# EAGLE design MyRIO_Breakout_Gamma2b (EAGLE 9.2.0)

## Sheet 1 of 2
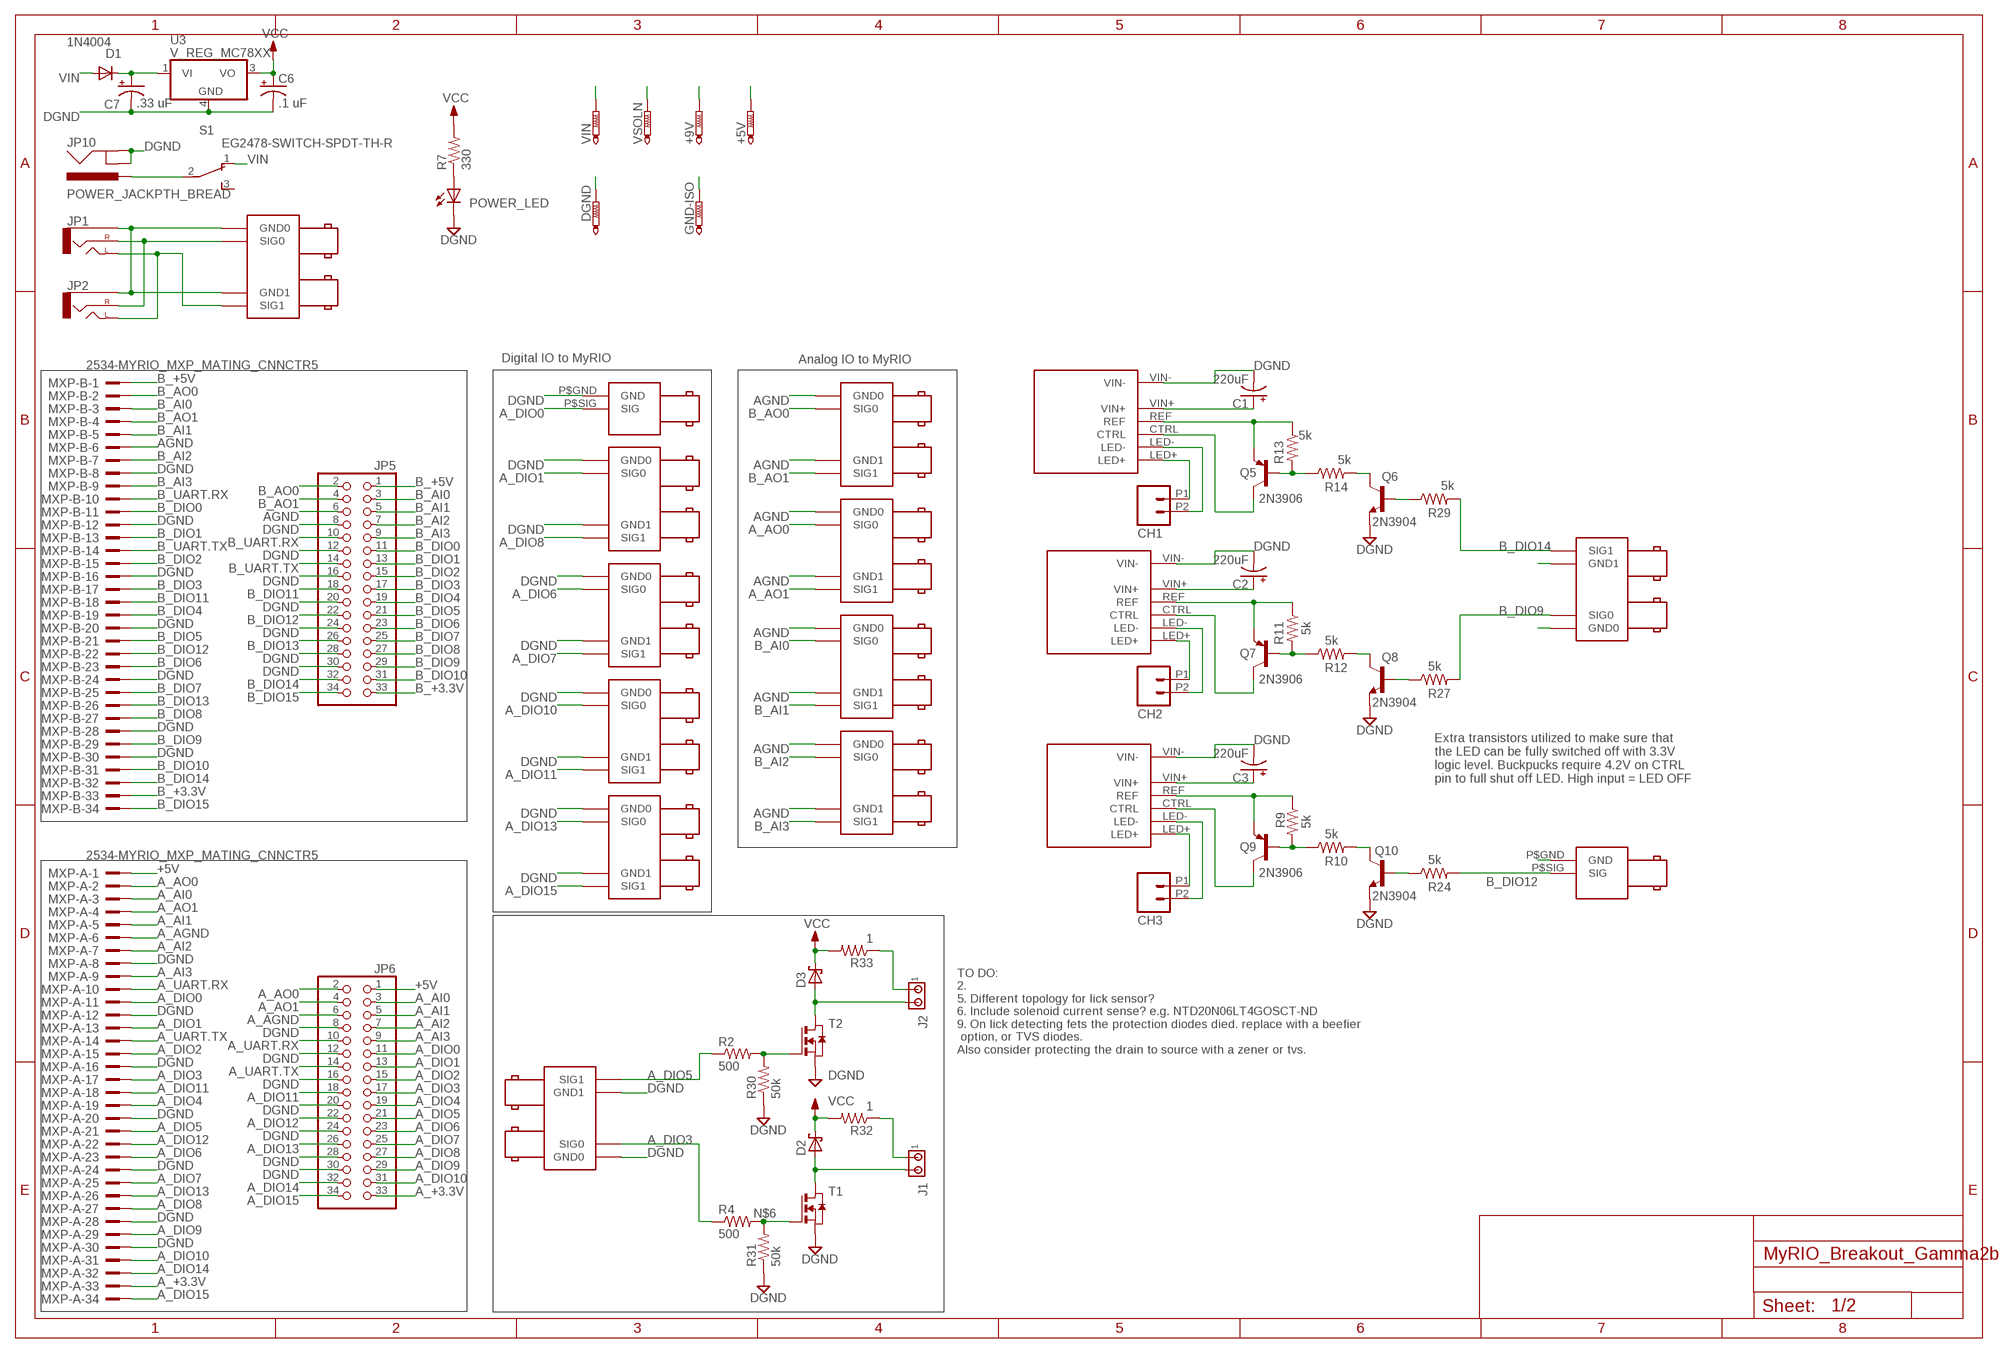
[diagram p0: schematic, sheet 1]

### Parts
+5V  PTR1PAD1-17Y  [P1-17Y]
+9V  PTR1PAD1-17Y  [P1-17Y]
AAO_0,1  BNC_RIGHT_ANGLE_DOUBLE  [BNC_RIGHT_ANGLE_DOUBLE]
ACTV_REC  BNC_RIGHT_ANGLE  [BNC_RIGHT_ANGLE]
AUDIO  BNC_RIGHT_ANGLE_DOUBLE  [BNC_RIGHT_ANGLE_DOUBLE]
BAI_0,1  BNC_RIGHT_ANGLE_DOUBLE  [BNC_RIGHT_ANGLE_DOUBLE]
BAI_2,3  BNC_RIGHT_ANGLE_DOUBLE  [BNC_RIGHT_ANGLE_DOUBLE]
BAO_0,1  BNC_RIGHT_ANGLE_DOUBLE  [BNC_RIGHT_ANGLE_DOUBLE]
BUCKPUCK1  BUCKPUCK-350-I  [BUCKPUCK_I]
BUCKPUCK2  BUCKPUCK-350-I  [BUCKPUCK_I]
BUCKPUCK3  BUCKPUCK-350-I  [BUCKPUCK_I]
C1  220uF  CPOL-USE5-10.5  [E5-10,5]
C2  220uF  CPOL-USE5-10.5  [E5-10,5]
C3  220uF  CPOL-USE5-10.5  [E5-10,5]
C6  .1 uF  CPOL-USE2.5-5  [E2,5-5]
C7  .33 uF  CPOL-USE2.5-5  [E2,5-5]
CAMERA  BNC_RIGHT_ANGLE_DOUBLE  [BNC_RIGHT_ANGLE_DOUBLE]
CH1  M022.54MM_SCREWTERM  [1X02_2.54_SCREWTERM]
CH2  M022.54MM_SCREWTERM  [1X02_2.54_SCREWTERM]
CH3  M022.54MM_SCREWTERM  [1X02_2.54_SCREWTERM]
D1  1N4004  [DO41-10]
D2  SCHOTTKY-DIODE  [DIODE_SMB]
D3  SCHOTTKY-DIODE  [DIODE_SMB]
D_FREE1_2  BNC_RIGHT_ANGLE_DOUBLE  [BNC_RIGHT_ANGLE_DOUBLE]
D_FREE3_4  BNC_RIGHT_ANGLE_DOUBLE  [BNC_RIGHT_ANGLE_DOUBLE]
DGND  PTR1PAD1-17Y  [P1-17Y]
GND-ISO  PTR1PAD1-17Y  [P1-17Y]
J1  MTA02-100  [10X02MTA]
J2  MTA02-100  [10X02MTA]
JP1  AUDIO-JACKPTH  [AUDIO-JACK]
JP2  AUDIO-JACKPTH  [AUDIO-JACK]
JP5  PINHD-2X17  [2X17]
JP6  PINHD-2X17  [2X17]
JP10  POWER_JACKPTH_BREAD  [POWER_JACK_PTH_BREAD]
LED_CUE  BNC_RIGHT_ANGLE  [BNC_RIGHT_ANGLE]
LED_MASK  BNC_RIGHT_ANGLE_DOUBLE  [BNC_RIGHT_ANGLE_DOUBLE]
MXP-A  2534-MYRIO_MXP_MATING_CNNCTR5  [PAK100/2500-5-34-MXP_CONNCTR]
MXP-B  2534-MYRIO_MXP_MATING_CNNCTR5  [PAK100/2500-5-34-MXP_CONNCTR]
POWER_LED  LED3MM  [LED3MM]
Q5  2N3906  MMBT3906LT1-PNP-SOT23-BEC  [SOT23-BEC]
Q6  2N3904  MMBT3904LT1-NPN-SOT23-BEC  [SOT23-BEC]
Q7  2N3906  MMBT3906LT1-PNP-SOT23-BEC  [SOT23-BEC]
Q8  2N3904  MMBT3904LT1-NPN-SOT23-BEC  [SOT23-BEC]
Q9  2N3906  MMBT3906LT1-PNP-SOT23-BEC  [SOT23-BEC]
Q10  2N3904  MMBT3904LT1-NPN-SOT23-BEC  [SOT23-BEC]
R2  500  R-US_M1206  [M1206]
R4  500  R-US_M1206  [M1206]
R7  330  R-US_0207/10  [0207/10]
R9  5k  RESISTOR_SM0805S  [0805S]
R10  5k  RESISTOR_SM0805S  [0805S]
R11  5k  RESISTOR_SM0805S  [0805S]
R12  5k  RESISTOR_SM0805S  [0805S]
R13  5k  RESISTOR_SM0805S  [0805S]
R14  5k  RESISTOR_SM0805S  [0805S]
R24  5k  RESISTOR_SM0805S  [0805S]
R27  5k  RESISTOR_SM0805S  [0805S]
R29  5k  RESISTOR_SM0805S  [0805S]
R30  50k  R-US_M1206  [M1206]
R31  50k  R-US_M1206  [M1206]
R32  1  R-US_M1206  [M1206]
R33  1  R-US_M1206  [M1206]
S1  EG2478-SWITCH-SPDT-TH-R  [ESWITCH_500-SSP1M6]
SHUTTER  BNC_RIGHT_ANGLE_DOUBLE  [BNC_RIGHT_ANGLE_DOUBLE]
SLN  BNC_RIGHT_ANGLE_DOUBLE  [BNC_RIGHT_ANGLE_DOUBLE]
T1  NMOSSOT223  [SOT223]
T2  NMOSSOT223  [SOT223]
U3  V_REG_MC78XX  [DPAK]
VIN  PTR1PAD1-17Y  [P1-17Y]
VSOLN  PTR1PAD1-17Y  [P1-17Y]

### Nets
+5V: +5V.TP JP6.1 MXP-A.1 ; also sheet 2
+9V: +9V.TP ; also sheet 2
A_+3.3V: JP6.33 MXP-A.33
A_AGND: JP6.6 MXP-A.6
A_AI0: JP6.3 MXP-A.3
A_AI1: JP6.5 MXP-A.5
A_AI2: JP6.7 MXP-A.7
A_AI3: JP6.9 MXP-A.9
A_AO0: AAO_0,1.P$SIG0(SIG0) JP6.2 MXP-A.2
A_AO1: AAO_0,1.P$SIG1(SIG1) JP6.4 MXP-A.4
A_DIO0: ACTV_REC.P$SIG(SIG) JP6.11 MXP-A.11
A_DIO1: CAMERA.P$SIG0(SIG0) JP6.13 MXP-A.13
A_DIO2: JP6.15 MXP-A.15 ; also sheet 2
A_DIO3: JP6.17 MXP-A.17 R4.1 SLN.P$SIG0(SIG0)
A_DIO4: JP6.19 MXP-A.19 ; also sheet 2
A_DIO5: JP6.21 MXP-A.21 R2.1 SLN.P$SIG1(SIG1)
A_DIO6: JP6.23 MXP-A.23 SHUTTER.P$SIG0(SIG0)
A_DIO7: JP6.25 MXP-A.25 SHUTTER.P$SIG1(SIG1)
A_DIO8: CAMERA.P$SIG1(SIG1) JP6.27 MXP-A.27
A_DIO9: JP6.29 MXP-A.29
A_DIO10: D_FREE1_2.P$SIG0(SIG0) JP6.31 MXP-A.31
A_DIO11: D_FREE1_2.P$SIG1(SIG1) JP6.18 MXP-A.18
A_DIO12: JP6.22 MXP-A.22
A_DIO13: D_FREE3_4.P$SIG0(SIG0) JP6.26 MXP-A.26
A_DIO14: JP6.32 MXP-A.32
A_DIO15: D_FREE3_4.P$SIG1(SIG1) JP6.34 MXP-A.34
A_UART.RX: JP6.10 MXP-A.10
A_UART.TX: JP6.14 MXP-A.14
AGND: AAO_0,1.P$GND0(GND0) AAO_0,1.P$GND1(GND1) BAI_0,1.P$GND0(GND0) BAI_0,1.P$GND1(GND1) BAI_2,3.P$GND0(GND0) BAI_2,3.P$GND1(GND1) BAO_0,1.P$GND0(GND0) BAO_0,1.P$GND1(GND1) JP5.6 MXP-B.6 ; also sheet 2
B_+3.3V: JP5.33 MXP-B.33
B_+5V: JP5.1 MXP-B.1
B_AI0: BAI_0,1.P$SIG0(SIG0) JP5.3 MXP-B.3
B_AI1: BAI_0,1.P$SIG1(SIG1) JP5.5 MXP-B.5
B_AI2: BAI_2,3.P$SIG0(SIG0) JP5.7 MXP-B.7
B_AI3: BAI_2,3.P$SIG1(SIG1) JP5.9 MXP-B.9
B_AO0: BAO_0,1.P$SIG0(SIG0) JP5.2 MXP-B.2
B_AO1: BAO_0,1.P$SIG1(SIG1) JP5.4 MXP-B.4
B_DIO0: JP5.11 MXP-B.11
B_DIO1: JP5.13 MXP-B.13
B_DIO2: JP5.15 MXP-B.15
B_DIO3: JP5.17 MXP-B.17
B_DIO4: JP5.19 MXP-B.19
B_DIO5: JP5.21 MXP-B.21
B_DIO6: JP5.23 MXP-B.23
B_DIO7: JP5.25 MXP-B.25
B_DIO8: JP5.27 MXP-B.27
B_DIO9: JP5.29 LED_MASK.P$SIG0(SIG0) MXP-B.29 R27.2
B_DIO10: JP5.31 MXP-B.31
B_DIO11: JP5.18 MXP-B.18
B_DIO12: JP5.22 LED_CUE.P$SIG(SIG) MXP-B.22 R24.2
B_DIO13: JP5.26 MXP-B.26
B_DIO14: JP5.32 LED_MASK.P$SIG1(SIG1) MXP-B.32 R29.2
B_DIO15: JP5.34 MXP-B.34
B_UART.RX: JP5.10 MXP-B.10
B_UART.TX: JP5.14 MXP-B.14
BCKPCK_CTRL2: Q8.C R12.2
BCKPCK_CTRL3: Q10.C R10.2
CTRL1: BUCKPUCK1.CTRL Q5.C
CTRL2: BUCKPUCK2.CTRL Q7.C
CTRL3: BUCKPUCK3.CTRL Q9.C
DGND: ACTV_REC.P$GND(GND) BUCKPUCK1.LED- BUCKPUCK1.VIN- BUCKPUCK2.LED- BUCKPUCK2.VIN- BUCKPUCK3.LED- BUCKPUCK3.VIN- C1.- C2.- C3.- C6.- C7.- CAMERA.P$GND0(GND0) CAMERA.P$GND1(GND1) CH1.P2 CH2.P2 CH3.P2 D_FREE1_2.P$GND0(GND0) D_FREE1_2.P$GND1(GND1) D_FREE3_4.P$GND0(GND0) D_FREE3_4.P$GND1(GND1) DGND.TP JP5.8 JP5.12 JP5.16 JP5.20 JP5.24 JP5.28 JP5.30 JP6.8 JP6.12 JP6.16 JP6.20 JP6.24 JP6.28 JP6.30 JP10.GND JP10.GNDBREAK LED_CUE.P$GND(GND) LED_MASK.P$GND0(GND0) LED_MASK.P$GND1(GND1) MXP-A.8 MXP-A.12 MXP-A.16 MXP-A.20 MXP-A.24 MXP-A.28 MXP-A.30 MXP-B.8 MXP-B.12 MXP-B.16 MXP-B.20 MXP-B.24 MXP-B.28 MXP-B.30 POWER_LED.K(C) Q6.E Q8.E Q10.E R30.1 R31.1 SHUTTER.P$GND0(GND0) SHUTTER.P$GND1(GND1) SLN.P$GND0(GND0) SLN.P$GND1(GND1) T1.3(S) T2.3(S) U3.4(GND) ; also sheet 2
GND-ISO: GND-ISO.TP ; also sheet 2
LED1+: BUCKPUCK1.LED+ CH1.P1
LED2+: BUCKPUCK2.LED+ CH2.P1
LED3+: BUCKPUCK3.LED+ CH3.P1
N$2: R2.2 R30.2 T2.1(G)
N$3: AUDIO.P$GND0(GND0) AUDIO.P$GND1(GND1) JP1.SLEEVE JP2.SLEEVE
N$4: AUDIO.P$SIG0(SIG0) JP1.RING(RIGHT) JP2.RING(RIGHT)
N$5: AUDIO.P$SIG1(SIG1) JP1.TIP(LEFT) JP2.TIP(LEFT)
N$6: R4.2 R31.2 T1.1(G)
N$11: BUCKPUCK3.REF Q9.E R9.1
N$13: POWER_LED.A R7.1
N$15: Q9.B R9.2 R10.1
N$16: BUCKPUCK1.VIN+ BUCKPUCK2.VIN+ BUCKPUCK3.VIN+ C1.+ C2.+ C3.+ C7.+ D1.C U3.1(VI) VIN.TP
N$22: BUCKPUCK1.REF Q5.E R13.1
N$24: BUCKPUCK2.REF Q7.E R11.1
N$27: Q10.B R24.1
N$28: Q8.B R27.1
N$29: Q5.B R13.2 R14.1
N$30: Q6.B R29.1
N$32: J1.1 R32.1
N$33: Q7.B R11.2 R12.1
N$36: JP10.PWR S1.2
N$37: J2.1 R33.1
N$42: Q6.C R14.2
VCC: C6.+ D2.C(A) D3.C(A) R7.2 R32.2 R33.2 U3.3(VO) VSOLN.TP
VIN: D1.A S1.1
VOUT-1: D2.A(C) J1.2 T1.2(D) T1.4(D)
VOUT-2: D3.A(C) J2.2 T2.2(D) T2.4(D)
Unconnected: S1.3

### Notes on the sheet
- Digital IO to MyRIO | Analog IO to MyRIO
- Extra transistors utilized to make sure that
  the LED can be fully switched off with 3.3V
  logic level. Buckpucks require 4.2V on CTRL
  pin to full shut off LED. High input = LED OFF
- TO DO:
  2. 
  5. Different topology for lick sensor?
  6. Include solenoid current sense? e.g. NTD20N06LT4GOSCT-ND
  9. On lick detecting fets the protection diodes died. replace with a beefier
   option, or TVS diodes. 
  Also consider protecting the drain to source with a zener or tvs.

## Sheet 2 of 2
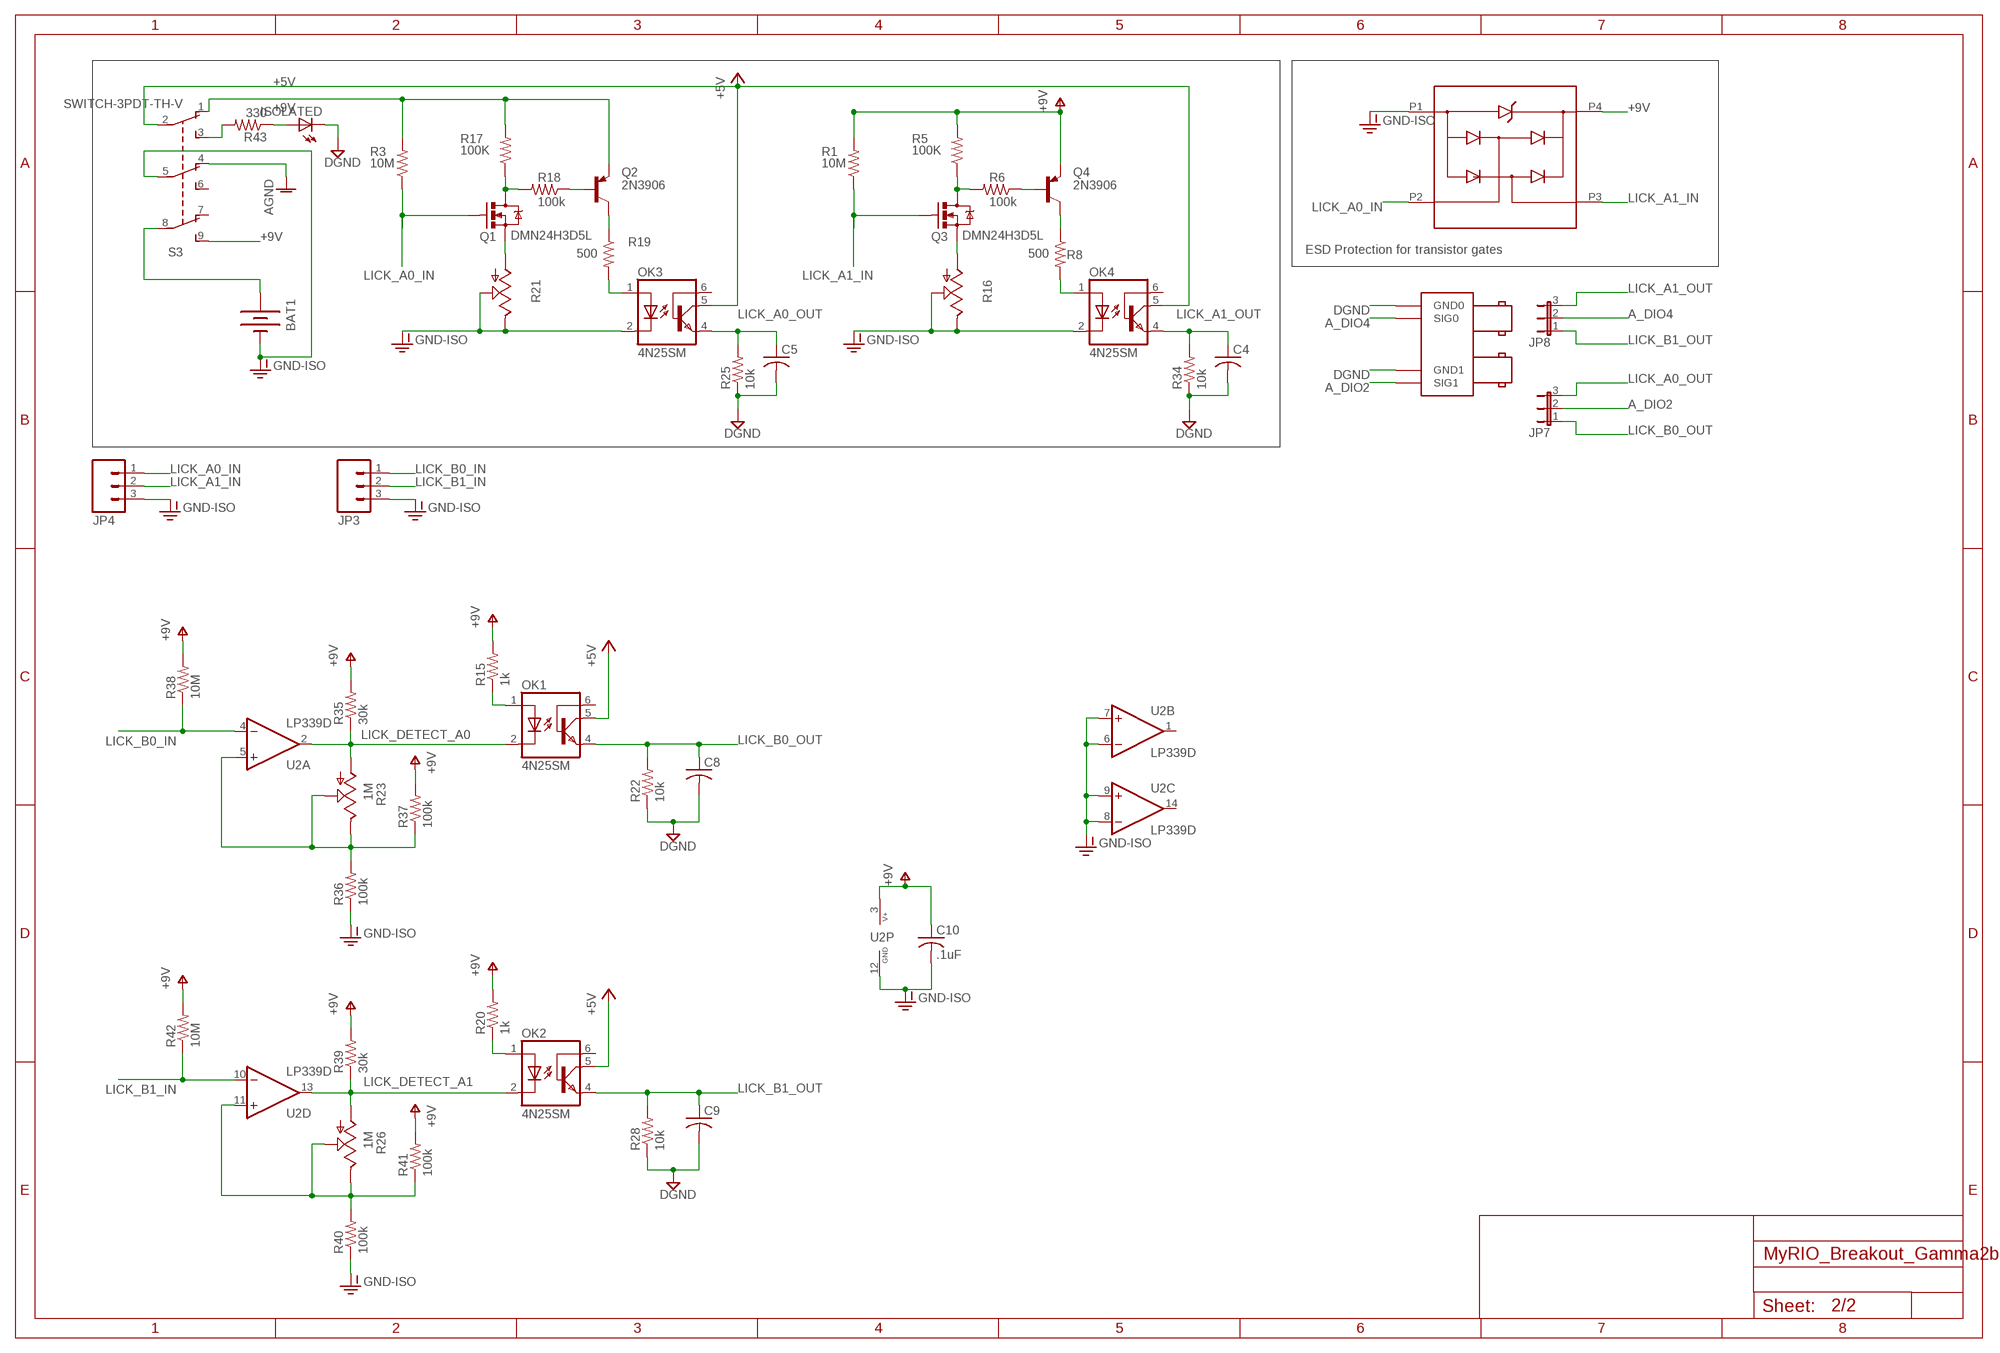
[diagram p1: schematic, sheet 2]

### Parts
BAT1  BATTERY9V  [BATTCON_9V]
C4  C-US025-024X044  [C025-024X044]
C5  C-US025-024X044  [C025-024X044]
C8  C-US025-024X044  [C025-024X044]
C9  C-US025-024X044  [C025-024X044]
C10  .1uF  C-USC0805K  [C0805K]
ISOLATED  LED3MM  [LED3MM]
JP3  M03POLAR  [MOLEX-1X3]
JP4  M03POLAR  [MOLEX-1X3]
JP7  JP2E  [JP2]
JP8  JP2E  [JP2]
LICK  BNC_RIGHT_ANGLE_DOUBLE  [BNC_RIGHT_ANGLE_DOUBLE]
OK1  4N25SM  [DIL6-SMD]
OK2  4N25SM  [DIL6-SMD]
OK3  4N25SM  [DIL6-SMD]
OK4  4N25SM  [DIL6-SMD]
Q1  DMN24H3D5L  MOSFET-NCHANNELAO3404A  [SOT23-3]
Q2  2N3906  MMBT3906LT1-PNP-SOT23-BEC  [SOT23-BEC]
Q3  DMN24H3D5L  MOSFET-NCHANNELAO3404A  [SOT23-3]
Q4  2N3906  MMBT3906LT1-PNP-SOT23-BEC  [SOT23-BEC]
R1  10M  RESISTOR_SM0805S  [0805S]
R3  10M  RESISTOR_SM0805S  [0805S]
R5  100K  RESISTOR_SM0805S  [0805S]
R6  100k  RESISTOR_SM0805S  [0805S]
R8  500  RESISTOR_SM0805S  [0805S]
R15  1k  R-US_M0805  [M0805]
R16  TRIM_US-B25P  [B25P]
R17  100K  RESISTOR_SM0805S  [0805S]
R18  100k  RESISTOR_SM0805S  [0805S]
R19  500  RESISTOR_SM0805S  [0805S]
R20  1k  R-US_M0805  [M0805]
R21  TRIM_US-B25P  [B25P]
R22  10k  R-US_0204/2V  [0204V]
R23  1M  TRIM_US-B25P  [B25P]
R25  10k  R-US_0204/2V  [0204V]
R26  1M  TRIM_US-B25P  [B25P]
R28  10k  R-US_0204/2V  [0204V]
R34  10k  R-US_0204/2V  [0204V]
R35  30k  R-US_M0805  [M0805]
R36  100k  R-US_M0805  [M0805]
R37  100k  R-US_M0805  [M0805]
R38  10M  R-US_M0805  [M0805]
R39  30k  R-US_M0805  [M0805]
R40  100k  R-US_M0805  [M0805]
R41  100k  R-US_M0805  [M0805]
R42  10M  R-US_M0805  [M0805]
R43  330  R-US_0207/10  [0207/10]
S3  SWITCH-3PDT-TH-V  [NKK-M20-9PIN-VERTICAL]
U1  CD143A-12_TVS  [SOT-143]
U2  LP339D  LM339D  [SO14]

### Nets
+5V: OK1.5(COL) OK2.5(COL) OK3.5(COL) OK4.5(COL) S3.2(P1) ; also sheet 1
+9V: C10.1 Q2.E Q4.E R1.2 R3.2 R5.2 R15.2 R17.2 R20.2 R35.2 R37.2 R38.2 R39.2 R41.2 R42.2 S3.1(O1) S3.9(S3) U1.P4 U2.3(P:V+) ; also sheet 1
A_DIO2: JP7.2 LICK.P$SIG1(SIG1) ; also sheet 1
A_DIO4: JP8.2 LICK.P$SIG0(SIG0) ; also sheet 1
AGND: S3.4(O2) ; also sheet 1
DGND: C4.2 C5.2 C8.2 C9.2 ISOLATED.K(C) LICK.P$GND0(GND0) LICK.P$GND1(GND1) R22.1 R25.1 R28.1 R34.1 ; also sheet 1
GND-ISO: BAT1.- C10.2 JP3.3 JP4.3 OK3.2(C) OK4.2(C) R16.E R16.S R21.E R21.S R36.1 R40.1 S3.5(P2) U1.P1 U2.6(B:-IN) U2.7(B:+IN) U2.8(C:-IN) U2.9(C:+IN) U2.12(P:GND) ; also sheet 1
LICK_A0_IN: JP4.1 Q1.1(G) R3.1 U1.P2
LICK_A0_OUT: C5.1 JP7.3 OK3.4(EMI) R25.2
LICK_A1_IN: JP4.2 Q3.1(G) R1.1 U1.P3
LICK_A1_OUT: C4.1 JP8.3 OK4.4(EMI) R34.2
LICK_B0_IN: JP3.1 R38.1 U2.4(A:-IN)
LICK_B0_OUT: C8.1 JP7.1 OK1.4(EMI) R22.2
LICK_B1_IN: JP3.2 R42.1 U2.10(D:-IN)
LICK_B1_OUT: C9.1 JP8.1 OK2.4(EMI) R28.2
LICK_DETECT_A0: OK1.2(C) R23.A R35.1 U2.2(A:OUT)
LICK_DETECT_A1: OK2.2(C) R26.A R39.1 U2.13(D:OUT)
N$1: Q1.3(D) R17.1 R18.2
N$7: Q3.3(D) R5.1 R6.2
N$8: Q4.B R6.1
N$9: OK4.1(A) R8.2
N$10: Q4.C R8.1
N$12: Q3.2(S) R16.A
N$14: Q2.B R18.1
N$17: OK3.1(A) R19.2
N$18: Q2.C R19.1
N$19: Q1.2(S) R21.A
N$20: BAT1.+ S3.8(P3)
N$21: ISOLATED.A R43.1
N$23: OK2.1(A) R20.1
N$25: R43.2 S3.3(S1)
N$34: OK1.1(A) R15.1
N$43: R23.E R23.S R36.2 R37.1 U2.5(A:+IN)
N$45: R26.E R26.S R40.2 R41.1 U2.11(D:+IN)
Unconnected: OK1.6(BAS) OK2.6(BAS) OK3.6(BAS) OK4.6(BAS) S3.6(S2) S3.7(O3) U2.1(B:OUT) U2.14(C:OUT)

### Notes on the sheet
- ESD Protection for transistor gates

## Library data of the parts
+5V +9V DGND GND-ISO VIN VSOLN = testpad:PTR1: TEST PIN
AAO_0,1 AUDIO BAI_0,1 BAI_2,3 BAO_0,1 CAMERA D_FREE1_2 D_FREE3_4 LED_MASK LICK SHUTTER SLN = Pavel_Connectors:BNC_RIGHT_ANGLE_DOUBLE
ACTV_REC LED_CUE = connectors:BNC_RIGHT_ANGLE: BNC plug, through-hole, right-angle
BAT1 = Pavel_ElectroMechanical:BATTERY: Battery Holders Various common sizes : AA, AAA, 18650 (PRT-12895), 20mm coin cell and 12mm coin cell. 20MM_4LEGS, BATT-10373 9V Digikey BH9v-PC-ND
BUCKPUCK1-BUCKPUCK3 = Pavel-PowerIC:BUCKPUCK-*-?
C1-C3 C6 C7 = adafruit:CPOL-US: POLARIZED CAPACITOR, American symbol
C4 C5 C8-C10 = adafruit:C-US: CAPACITOR, American symbol
CH1-CH3 = SparkFun-Connectors:M02: Standard 2-pin 0.1" header. Use with - straight break away headers ( PRT-00116) - right angle break away headers (PRT-00553) - swiss pins (PRT-00743) - machine pins (PRT-00117) - female headers (PRT-00115) Molex polarized connector foot print use with: PRT-08233 with associated crimp pins and housings. 2.54_SCREWTERM for use with PRT-10571. 3.5mm Screw Terminal footprints for PRT-08084 5mm Screw Terminal footprints for use with PRT-08432
D1 = adafruit:1N4004: DIODE General purpose 1N400x type rectifier (With bigger pads) http://www.ladyada.net/library/pcb/eaglelibrary.html
D2 D3 = eagle-ltspice:SCHOTTKY-DIODE: Schottky Diode; SPICEMODEL: NONE; SPICEPREFIX: D; SPICETYPE: diode
ISOLATED POWER_LED = led:LED: LED OSRAM: - CHIPLED LG R971, LG N971, LY N971, LG Q971, LY Q971, LO R971, LY R971 LH N974, LH R974 LS Q976, LO Q976, LY Q976 LO Q996 - Hyper CHIPLED LW Q18S LB Q993, LB Q99A, LB R99A - SideLED LS A670, LO A670, LY A670, LG A670, LP A670 LB A673, LV A673, LT A673, LW A673 LH A674 LY A675 LS A676, LA A676, LO A676, LY A676, LW A676 LS A679, LY A679, LG A679 - Hyper Micro SIDELED® LS Y876, LA Y876, LO Y876, LY Y876 LT Y87S - SmartLED LW L88C, LW L88S LB L89C, LB L89S, LG L890 LS L89K, LO L89K, LY L89K LS L896, LA L896, LO L896, LY L896 - TOPLED LS T670, LO T670, LY T670, LG T670, LP T670 LSG T670, LSP T670, LSY T670, LOP T670, LYG T670 LG T671, LOG T671, LSG T671 LB T673, LV T673, LT T673, LW T673 LH T674 LS T676, LA T676, LO T676, LY T676, LB T676, LH T676, LSB T676, LW T676 LB T67C, LV T67C, LT T67C, LS T67K, LO T67K, LY T67K, LW E67C LS E67B, LA E67B, LO E67B, LY E67B, LB E67C, LV E67C, LT E67C LW T67C LS T679, LY T679, LG T679 LS T770, LO T770, LY T770, LG T770, LP T770 LB T773, LV T773, LT T773, LW T773 LH T774 LS E675, LA E675, LY E675, LS T675 LS T776, LA T776, LO T776, LY T776, LB T776 LHGB T686 LT T68C, LB T68C - Hyper Mini TOPLED® LB M676 - Mini TOPLED Santana® LG M470 LS M47K, LO M47K, LY M47K Source: http://www.osram.convergy.de LUXEON: - LUMILED® LXK2-PW12-R00, LXK2-PW12-S00, LXK2-PW14-U00, LXK2-PW14-V00 LXK2-PM12-R00, LXK2-PM12-S00, LXK2-PM14-U00 LXK2-PE12-Q00, LXK2-PE12-R00, LXK2-PE12-S00, LXK2-PE14-T00, LXK2-PE14-U00 LXK2-PB12-K00, LXK2-PB12-L00, LXK2-PB12-M00, LXK2-PB14-N00, LXK2-PB14-P00, LXK2-PB14-Q00 LXK2-PR12-L00, LXK2-PR12-M00, LXK2-PR14-Q00, LXK2-PR14-R00 LXK2-PD12-Q00, LXK2-PD12-R00, LXK2-PD12-S00 LXK2-PH12-R00, LXK2-PH12-S00 LXK2-PL12-P00, LXK2-PL12-Q00, LXK2-PL12-R00 Source: www.luxeon.com KINGBRIGHT: KA-3528ASYC Source: www.kingbright.com
J1 J2 = con-amp:MTA02-100: AMP connector
JP1 JP2 = SparkFun-Connectors:AUDIO-JACK: 3.5mm Audio Jack Simple 3.5mm common PCB mount audio jack. Variant PTH is our storefront SKU PRT-08032
JP3 JP4 = SparkFun:M03: Header 3 Standard 3-pin 0.1" header. Use with straight break away headers (SKU : PRT-00116), right angle break away headers (PRT-00553), swiss pins (PRT-00743), machine pins (PRT-00117), and female headers (PRT-00115). Molex polarized connector foot print use with SKU : PRT-08232 with associated crimp pins and housings.
JP5 JP6 = pinhead:PINHD-2X17: PIN HEADER
JP7 JP8 = jumper:JP2E: JUMPER
JP10 = SparkFun-Connectors:POWER_JACK: Power Jack Connector This is the standard 5.5mm barrel jack for power. The PTH is the most common, proven, reliable, footprint. The Slot footprint only works if the mill layer is transmitted to the PCB fab house so be warned. Here are the connectors we sell at SparkFun: DC Barrel Power Jack/Connector <https://www.sparkfun.com/products/119> (PRT-00119) DC Barrel Power Jack/Connector (SMD) <https://www.sparkfun.com/products/12748> (PRT-12748) DC Barrel Jack Adapter - Breadboard Compatible <https://www.sparkfun.com/products/10811> (PRT-10811) It is used on this SparkFun product (and many, many others): SparkFun RedBoard - Programmed with Arduino <https://www.sparkfun.com/products/12757> (DEV-12757) Also, if you need a mating power supply or connector, please check these out: Wall Adapter Power Supply - 9VDC 650mA <https://www.sparkfun.com/products/298> (TOL-00298) DC Barrel Jack Adapter - Male <https://www.sparkfun.com/products/10287> (PRT-10287); PROD_ID: PRT-10811
MXP-A MXP-B = Pavel_ElectroMechanical:2534-MYRIO_MXP_MATING_CNNCTR: 3M (TM) Pak 100 4-Wall Header Source: 3M; OC_FARNELL: 9838406; OC_NEWARK: unknown
OK1-OK4 = optocoupler:4N*?M: General Purpose 6-Pin Phototransistor Optocouplers Source: http://www.fairchildsemi.com/ds/4N/4N35-M.pdf; MF: FAIRCHILD SEMICONDUCTOR; MPN: 4N25SM; OC_FARNELL: 1021152; OC_NEWARK: 34C2020
Q1 Q3 = SparkFun-DiscreteSemi:MOSFET-NCHANNEL: Common NMOSFET Parts MFG P/N Store ID Prod ID FDD8780 TRANS-09984 SI7820DN TRANS-11055 FDS6630A IC-08089 2N7002PW TRANS-11151 FQP30N06L COM-10213 TRANS-10060 BSS123LT1G TRANS-08345 BSS138 TRANS-00830 BS170 2N7000; PROD_ID: TRAN-12988
Q2 Q4 Q5 Q7 Q9 = transistor:*-PNP-: PNP Transistror
Q6 Q8 Q10 = transistor-neu-to92:*-NPN-: NPN Transistror
R1 R3 R5 R6 R8-R14 R17-R19 R24 R27 R29 = SteveS:RESISTOR_SM
R2 R4 R7 R15 R20 R22 R25 R28 R30-R43 = adafruit:R-US_: RESISTOR, American symbol
R16 R21 R23 R26 = pot:TRIM_US-: POTENTIOMETER
S1 = Pavel_ElectroMechanical:EG2478-SWITCH-SPDT-TH-R: E-Switch 500 series right-angle slide SPDT Part EG2478-ND<a=https://www.digikey.com/product-detail/en/e-switch/500SSP1S1M6QEA/EG2478-ND/378947>
S3 = Pavel_ElectroMechanical:SWITCH-3PDT-TH-V: 3PDT 9 pin footswitch SF17020F-0302-21R-L Source: 3PDT.jpg
T1 T2 = zetex:NMOSSOT223: MOS FET; OC_FARNELL: unknown; OC_NEWARK: unknown
U1 = Pavel_ICs:CD143A-12_TVS: Bourns TVS Array for data line protection DigiKey PN CD143A-SR12CT-ND
U2 = op-amp:LM339: COMPARATOR - Quad Low Power Low Offset Voltage with open collector; LM139/LM239/LM339/LM2901/LM3302
U3 = Pavel-PowerIC:V_REG_MC78XX: DigiKey MC7815BD2TR4GOSDKR-ND TO-263-3, D2Pak, TO-263AB http://www.digikey.com/product-detail/en/MC7815BD2TR4G/MC7815BD2TR4GOSDKR-ND/3462629

## Net classes
1 power: width 0.508 mm

## Board
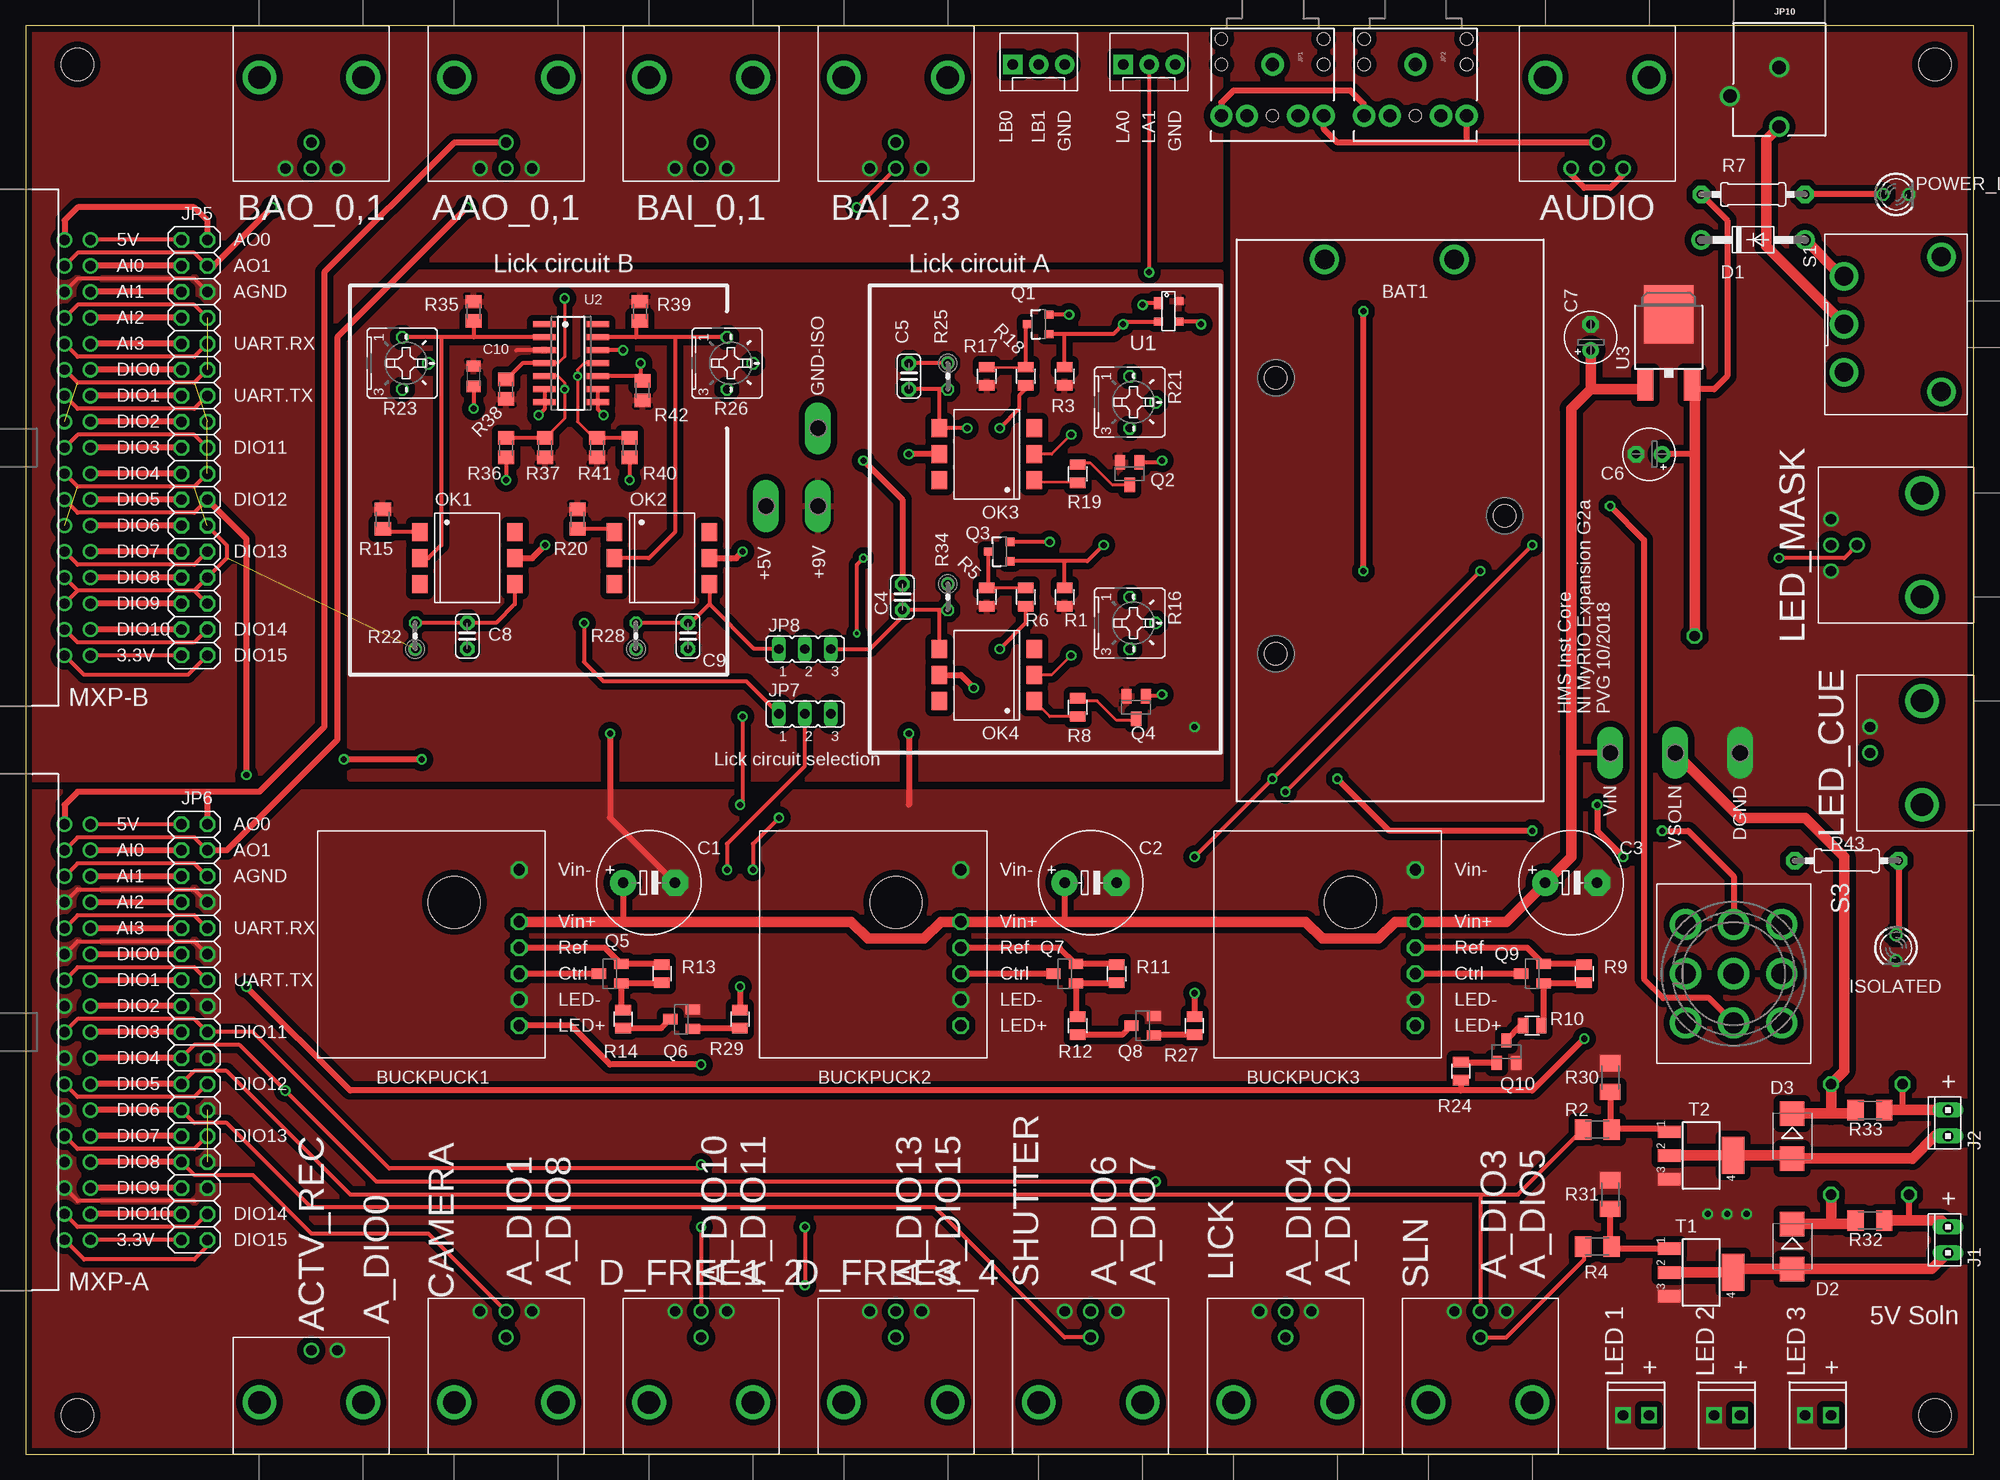
[diagram p2: board, top side]
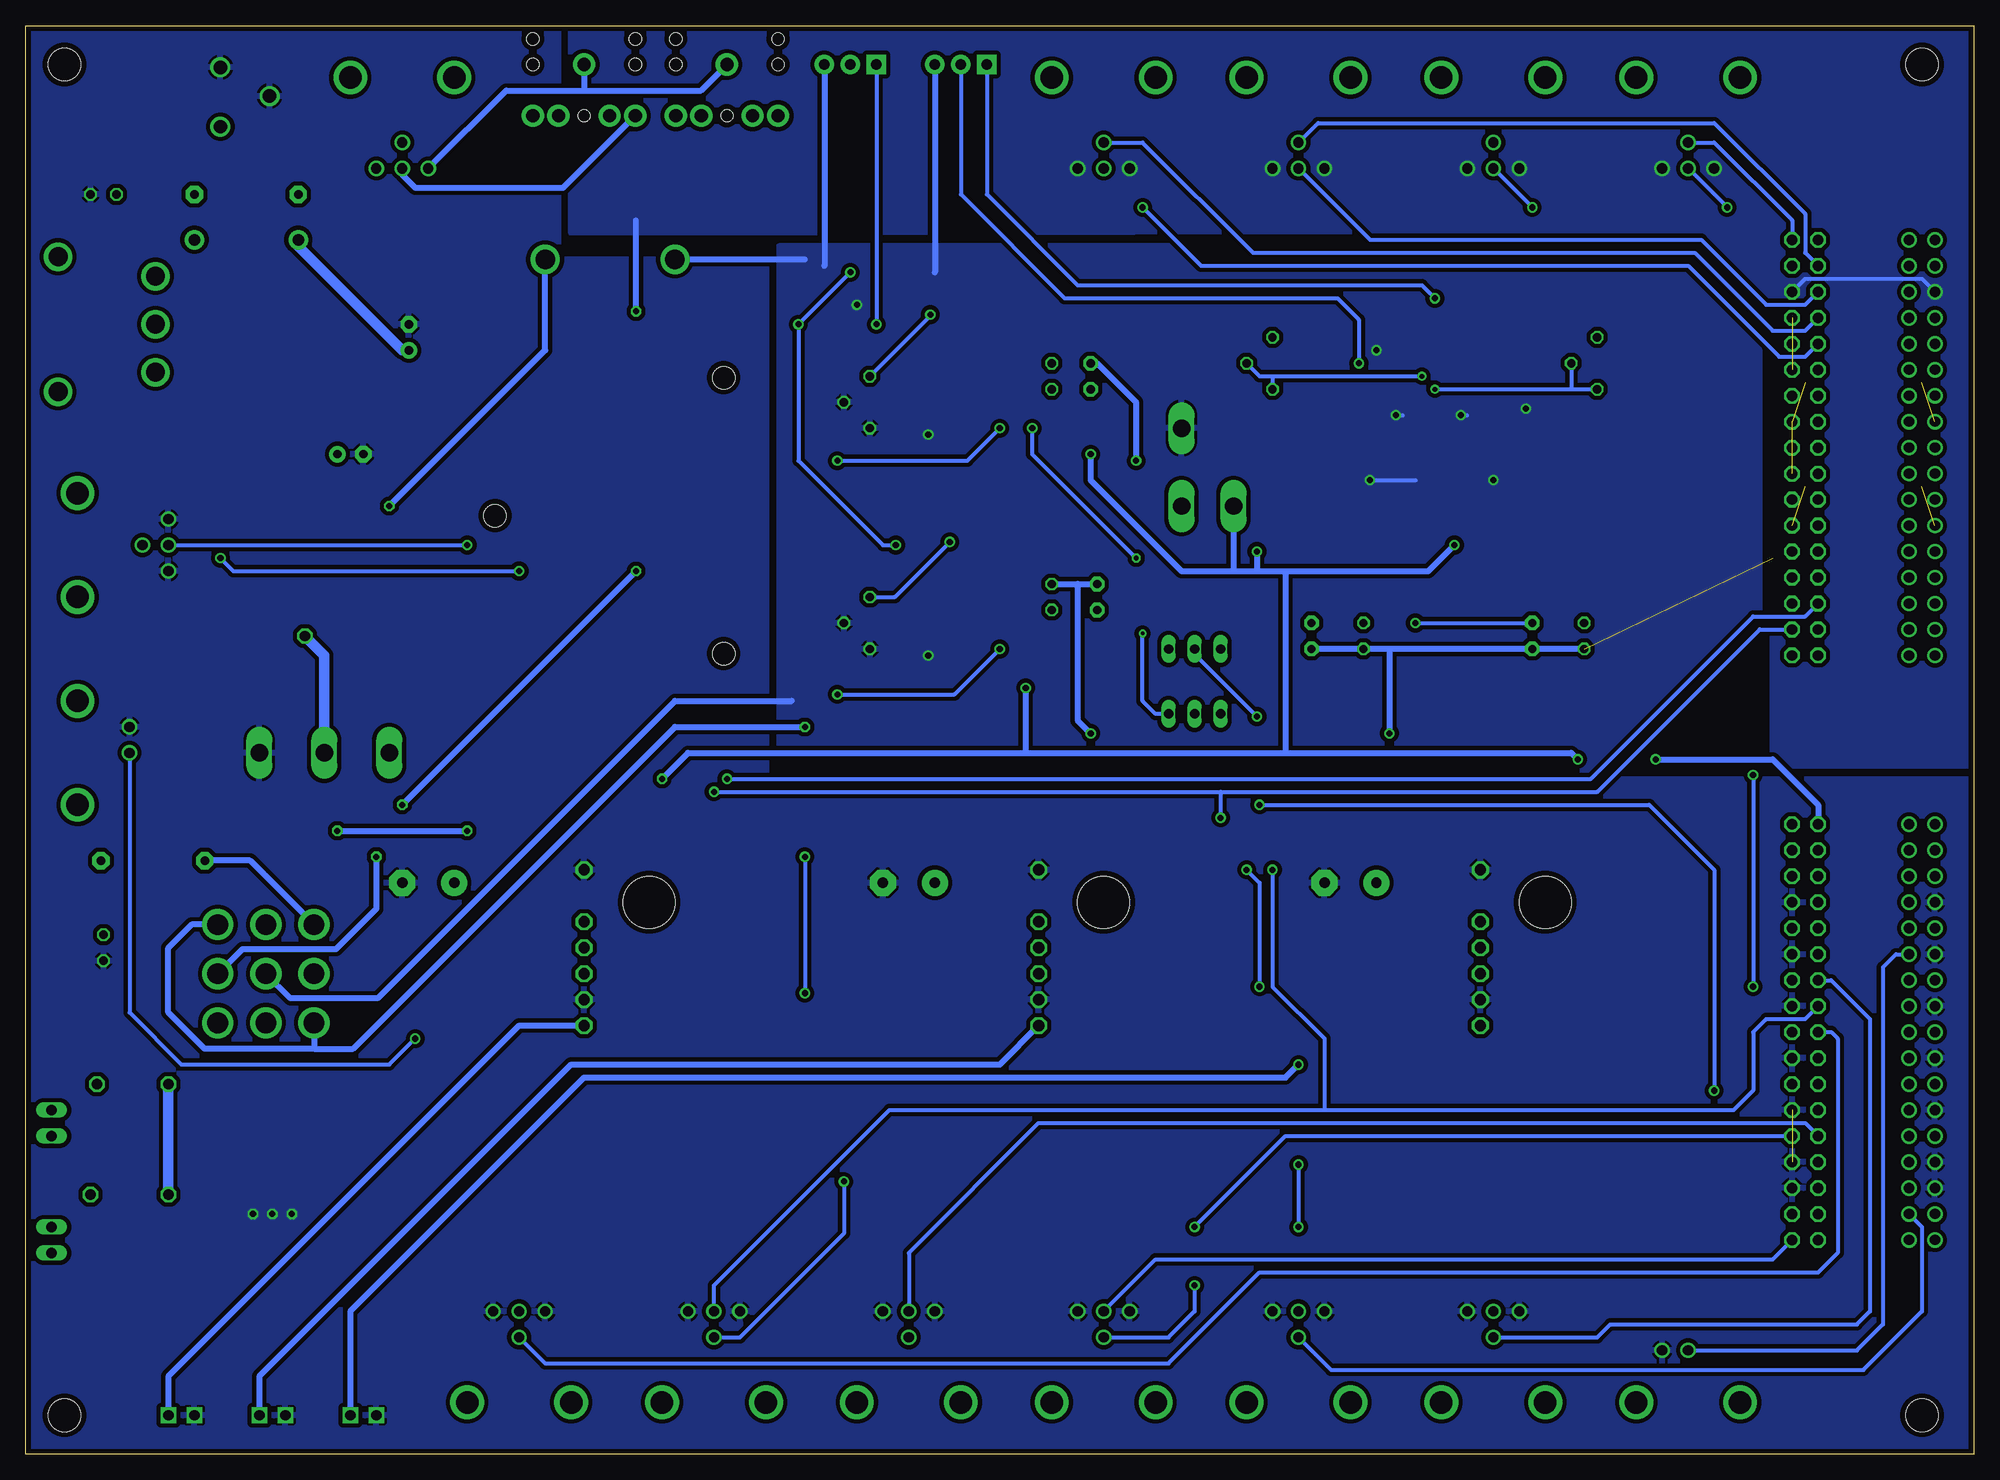
[diagram p3: board, bottom side, seen from below]

Size 190.5 x 139.7 mm. Coordinates in mm from the lower left corner, seen from the top.
Outline: 0,0 190.48,0 190.5,139.7 0,139.7 0,0
Copper layers (1*16): Top 0.0178mm / dielectric 59mil / Bottom 0.0178mm
Design rules "SSC-EAGLE-2Lyr_v1.0.0.3": minimum track width 6mil, minimum drill 14mil, track to track 6mil, track to pad 6mil, pad to pad 6mil, via to via 6mil, smd to smd 6mil, copper to edge 20mil, drill to drill 16mil, minimum pad ring 8mil, minimum via ring 8mil, stop-mask expansion 3mil, vias tented up to drill 0mil, thermal gap 10mil
Holes 3.2 mm at 5.08,3.81 186.69,3.81 186.69,135.89 5.08,135.89

### Footprints (pad centres in the part's own frame; a part is rotated, then mirrored left to right if it is on the bottom)
P1-17Y = drill 1.702 pad 2.121 long: TP 0,0
BNC_RIGHT_ANGLE_DOUBLE = drill 2.2: P$1 0,-5.08; P$2 0,5.08 | drill 1: P$GND0 8.89,-2.54; P$GND1 8.89,2.54; P$SIG0 6.35,0; P$SIG1 8.89,0
BNC_RIGHT_ANGLE = drill 2.2: P$1 -5.08,-6.35; P$2 5.08,-6.35 | drill 1: P$GND -2.54,-11.43; P$SIG 0,-11.43
BATTCON_9V = drill 1.905: + 0,-12.7; - 0,0 | hole 2.2: -11.582,4.75; -38.557,4.75; -25.07,-17.602
BUCKPUCK_I = drill 1.1 octagon: CTRL -8.89,2.54; LED+ -8.89,7.62; LED- -8.89,5.08; REF -8.89,0; VIN+ -8.89,-2.54; VIN- -8.89,-7.62 | hole 5.08: -2.54,-4.445
E5-10,5 = drill 1.016 pad 2.54: + -2.54,0 | drill 1.016 pad 2.54 octagon: - 2.54,0
C025-024X044 = drill 0.813 pad 1.422 octagon: 1 -1.27,0; 2 1.27,0
E2,5-5 = drill 0.813 pad 1.6: + -1.27,0 | drill 0.813 pad 1.6 octagon: - 1.27,0
C0805K = smd 1.1 x 1.4: 1 -1,0; 2 1,0
1X02_2.54_SCREWTERM = drill 1.016 square: P1 2.54,0; P2 0,0
DO41-10 = drill 1.118 pad 1.93: A 5.08,0; C -5.08,0
DIODE_SMB = smd 2.4 x 2.4: A 2.2,0; C -2.2,0
LED3MM = drill 0.813 octagon: A -1.27,0; K 1.27,0
10X02MTA = drill 1.016 long: 1 1.27,0; 2 -1.27,0
AUDIO-JACK = drill 1.3 pad 2.184: RING 5,5; RSH 5,2.5; SLEEVE 0,0; TIP 5,-5; TSH 5,-2.5 | hole 1.2: 0,5; -2.5,5; -2.5,-5; 0,-5; 5,0
MOLEX-1X3 = drill 1.016 pad 1.88 square: 1 0,0 | drill 1.016 pad 1.88: 2 2.54,0; 3 5.08,0
2X17 = drill 1.016 octagon: 1 -20.32,-1.27; 2 -20.32,1.27; 3 -17.78,-1.27; 4 -17.78,1.27; 5 -15.24,-1.27; 6 -15.24,1.27; 7 -12.7,-1.27; 8 -12.7,1.27; 9 -10.16,-1.27; 10 -10.16,1.27; 11 -7.62,-1.27; 12 -7.62,1.27; 13 -5.08,-1.27; 14 -5.08,1.27; 15 -2.54,-1.27; 16 -2.54,1.27; 17 0,-1.27; 18 0,1.27; 19 2.54,-1.27; 20 2.54,1.27; 21 5.08,-1.27; 22 5.08,1.27; 23 7.62,-1.27; 24 7.62,1.27; 25 10.16,-1.27; 26 10.16,1.27; 27 12.7,-1.27; 28 12.7,1.27; 29 15.24,-1.27; 30 15.24,1.27; 31 17.78,-1.27; 32 17.78,1.27; 33 20.32,-1.27; 34 20.32,1.27
JP2 = drill 0.914 long: 1 -2.54,0; 2 0,0; 3 2.54,0
POWER_JACK_PTH_BREAD = drill 1.3: GND 0,7.9; GNDBREAK 4.8,10.7; PWR 0,13.7
PAK100/2500-5-34-MXP_CONNCTR = drill 1 pad 1.422: 1 20.32,-1.27; 2 20.32,1.27; 3 17.78,-1.27; 4 17.78,1.27; 5 15.24,-1.27; 6 15.24,1.27; 7 12.7,-1.27; 8 12.7,1.27; 9 10.16,-1.27; 10 10.16,1.27; 11 7.62,-1.27; 12 7.62,1.27; 13 5.08,-1.27; 14 5.08,1.27; 15 2.54,-1.27; 16 2.54,1.27; 17 0,-1.27; 18 0,1.27; 19 -2.54,-1.27; 20 -2.54,1.27; 21 -5.08,-1.27; 22 -5.08,1.27; 23 -7.62,-1.27; 24 -7.62,1.27; 25 -10.16,-1.27; 26 -10.16,1.27; 27 -12.7,-1.27; 28 -12.7,1.27; 29 -15.24,-1.27; 30 -15.24,1.27; 31 -17.78,-1.27; 32 -17.78,1.27; 33 -20.32,-1.27; 34 -20.32,1.27
DIL6-SMD = smd 1.78 x 1.52: 1 -2.54,-4.645; 2 0,-4.645; 3 2.54,-4.645; 4 2.54,4.645; 5 0,4.645; 6 -2.54,4.645
SOT23-3 = smd 0.8 x 0.9: 1 -0.95,-1; 2 0.95,-1; 3 0,1.1
SOT23-BEC = smd 1 x 1.4: B -0.95,-1.1; C 0,1.1; E 0.95,-1.1
0805S = smd 1.016 x 1.524: 1 -0.889,0; 2 0.889,0
M1206 = smd 1.6 x 2: 1 -1.4,0; 2 1.4,0
0207/10 = drill 0.813 pad 1.676 octagon: 1 -5.08,0; 2 5.08,0
M0805 = smd 1.3 x 1.6: 1 -0.95,0; 2 0.95,0
B25P = drill 0.813 octagon: A -2.54,0; E 2.54,0; S 0,2.54
0204V = drill 0.813 octagon: 1 -1.27,0; 2 1.27,0
ESWITCH_500-SSP1M6 = drill 1.854: 1 -4.699,-5.08; 2 0,-5.08; 3 4.699,-5.08; MT1 -6.604,4.445; MT2 6.604,4.445
NKK-M20-9PIN-VERTICAL = drill 2.032: 1 -4.801,4.699; 2 -4.801,0; 3 -4.801,-4.699; 4 0,4.699; 5 0,0; 6 0,-4.699; 7 4.801,4.699; 8 4.801,0; 9 4.801,-4.699
SOT223 = smd 1.219 x 2.235: 1 -2.311,-3.099; 2 0,-3.099; 3 2.311,-3.099 | smd 3.6 x 2.2: 4 0,3.099
SOT-143 = smd 0.9 x 1.2: P1 -1,0.8 | smd 0.9 x 0.8: P2 -1,-1; P3 1,-1; P4 1,1
SO14 = smd 0.6 x 2.2: 1 -3.81,-2.6; 2 -2.54,-2.6; 3 -1.27,-2.6; 4 0,-2.6; 5 1.27,-2.6; 6 2.54,-2.6; 7 3.81,-2.6; 8 3.81,2.6; 9 2.54,2.6; 10 1.27,2.6; 11 0,2.6; 12 -1.27,2.6; 13 -2.54,2.6; 14 -3.81,2.6
DPAK = smd 1.6 x 3: 1 -2.28,-5.31; 3 2.28,-5.31 | smd 4.826 x 5.715: 4 0,1.588

### Placement (x,y rotation side)
+5V  72.39,92.71 0 top
+9V  77.47,92.71 0 top
AAO_0,1  46.99,134.62 270 top
ACTV_REC  27.94,-1.27 180 top
AUDIO  153.67,134.62 270 top
BAI_0,1  66.04,134.62 270 top
BAI_2,3  85.09,134.62 270 top
BAO_0,1  27.94,134.62 270 top
BAT1  127,116.84 90 top
BUCKPUCK1  39.37,49.53 180 top
BUCKPUCK2  82.55,49.53 180 top
BUCKPUCK3  127,49.53 180 top
C1  60.96,55.88 0 top
C2  104.14,55.88 0 top
C3  151.13,55.88 0 top
C4  85.72,83.82 90 top
C5  86.36,105.41 90 top
C6  158.75,97.79 180 top
C7  153.03,109.22 90 top
C8  43.18,80.01 270 top
C9  64.77,80.01 270 top
C10  43.81,105.41 270 top
CAMERA  46.99,5.08 90 top
CH1  156.21,3.81 0 top
CH2  165.1,3.81 0 top
CH3  173.99,3.81 0 top
D1  168.91,118.75 0 top
D2  172.72,20.32 270 top
D3  172.72,31.11 270 top
D_FREE1_2  66.04,5.08 90 top
D_FREE3_4  85.09,5.08 90 top
DGND  167.64,68.58 0 top
GND-ISO  77.47,100.33 0 top
ISOLATED  182.88,49.53 270 top
J1  187.96,20.95 90 top
J2  187.96,32.38 90 top
JP1  121.92,135.89 270 top
JP2  135.89,135.89 270 top
JP3  96.52,135.89 0 top
JP4  107.31,135.89 0 top
JP5  16.51,98.42 270 top
JP6  16.51,41.27 270 top
JP7  76.2,72.39 0 top
JP8  76.2,78.74 0 top
JP10  171.45,143.51 180 top
LED_CUE  191.77,68.58 270 top
LED_MASK  185.42,88.9 180 top
LICK  123.19,5.08 90 top
MXP-A  5.08,41.27 90 top
MXP-B  5.08,98.42 90 top
OK1  43.18,87.63 270 top
OK2  62.23,87.63 270 top
OK3  93.98,97.79 90 top
OK4  93.98,76.2 90 top
POWER_LED  182.88,123.19 0 top
Q1  99.06,110.49 90 top
Q2  107.95,95.89 180 top
Q3  95.25,88.27 90 top
Q4  108.58,73.03 180 top
Q5  57.15,46.99 90 top
Q6  64.14,42.55 90 top
Q7  101.6,46.99 90 top
Q8  109.22,41.91 90 top
Q9  147.32,46.99 90 top
Q10  144.78,39.37 0 top
R1  101.6,83.82 270 top
R2  153.67,31.75 0 top
R3  101.6,105.41 270 top
R4  153.67,20.32 0 top
R5  93.98,83.82 270 top
R6  97.79,83.82 90 top
R7  168.91,123.19 180 top
R8  102.87,73.03 270 top
R9  152.4,46.99 270 top
R10  147.32,41.91 180 top
R11  106.68,46.99 270 top
R12  102.87,41.91 270 top
R13  62.23,46.99 270 top
R14  58.42,42.55 270 top
R15  34.92,91.44 90 top
R16  107.95,81.28 270 top
R17  93.98,105.41 270 top
R18  97.79,105.41 90 top
R19  102.87,95.89 270 top
R20  53.98,91.44 90 top
R21  107.95,102.87 270 top
R22  38.1,80.01 90 top
R23  36.83,106.68 270 top
R24  140.34,37.47 270 top
R25  90.17,105.41 270 top
R26  68.58,106.68 270 top
R27  114.3,41.91 90 top
R28  59.69,80.01 90 top
R29  69.85,42.55 90 top
R30  154.94,36.83 270 top
R31  154.94,25.4 270 top
R32  180.34,22.86 180 top
R33  180.34,33.66 180 top
R34  90.17,83.82 270 top
R35  43.81,111.76 90 top
R36  46.99,98.42 90 top
R37  50.8,98.42 270 top
R38  46.99,104.14 270 top
R39  60.07,111.76 90 top
R40  59.05,98.42 90 top
R41  55.88,98.42 270 top
R42  60.33,104.01 270 top
R43  178.05,58.04 180 top
S1  182.88,110.49 270 top
S3  167,46.99 270 top
SHUTTER  104.14,5.08 90 top
SLN  142.24,5.08 90 top
T1  163.83,17.78 270 top
T2  163.83,29.21 270 top
U1  111.76,111.76 0 top
U2  53.34,106.68 270 top
U3  160.66,109.86 0 top
VIN  154.94,68.58 0 top
VSOLN  161.29,68.58 0 top

### Tracks (layer width: path | path; a pad name or v marks a point on that pad's centre or on a via)
+5V  (via drill 0.6)
  Top 0.406: JP6.1 MXP-A.1
  Top 0.61: OK3.5 v86.36,97.79 | v92.71,74.93 91.44,76.2 OK4.5 | v38.73,67.94 v31.11,67.94 | v128.27,66.04 133.35,60.96 v147.32,60.96 | v160.02,60.96 162.56,60.96 167,56.52 S3.2 | OK1.5 49.53,87.63 v50.8,88.9 | OK2.5 69.47,87.63 v70.1,88.27
  Bottom 0.61: v31.11,67.94 19.68,67.94 15.24,63.5 JP6.1 | 70.1,86.36 67.31,86.36 | 67.31,86.36 53.34,86.36 v50.8,88.9 | v86.36,97.79 86.36,95.25 77.47,86.36 72.39,86.36 | 67.31,86.36 67.31,68.58 | v128.27,66.04 125.73,68.58 92.71,68.58 | 92.71,68.58 67.31,68.58 | v160.02,60.96 v147.32,60.96 | 67.31,68.58 39.37,68.58 v38.73,67.94 | 72.39,86.36 70.1,86.36 | v70.1,88.27 70.1,86.36 | +5V.TP 72.39,86.36 | v92.71,74.93 92.71,68.58
+9V  (via drill 0.6)
  Top 0.406: U2.3 48.01,107.95
  Bottom 0.61: 162.31,39.65 158.47,39.65 127,71.12 v114.3,71.12 | S3.1 174.27,51.79 176.53,49.53 176.53,43.18 173,39.65 162.31,39.65 | S3.9 162.31,39.65
  pour Top (isolate 0.61): 31.75,109.22 38.1,115.57 116.84,115.57 116.84,66.04 31.75,66.04
A_+3.3V
  Top 0.406: JP6.33 MXP-A.33
A_AGND
  Top 0.406: JP6.6 16.51,57.78 5.08,57.78 MXP-A.6
A_AI0
  Top 0.61: JP6.3 MXP-A.3
A_AI1
  Top 0.61: JP6.5 MXP-A.5
A_AI2
  Top 0.61: JP6.7 MXP-A.7
A_AI3
  Top 0.61: JP6.9 MXP-A.9
A_AO0
  Top 0.61: MXP-A.2 3.81,63.5 5.08,64.77 17.78,64.77 | 17.78,64.77 JP6.2 | 17.78,64.77 22.86,64.77 29.21,71.12 29.21,115.57 41.91,128.27 AAO_0,1.P$SIG0
A_AO1  (via drill 0.6)
  Top 0.406: MXP-A.4 5.08,60.33 16.51,60.33 JP6.4
  Top 0.61: JP6.4 19.68,59.05 30.48,69.85 30.48,109.22 v43.18,121.92
  Bottom 0.406: AAO_0,1.P$SIG1 v43.18,121.92
A_DIO0
  Top 0.61: JP6.11 MXP-A.11
  Bottom 0.406: MXP-A.11 7.62,48.9 8.89,47.62 8.89,12.7 11.43,10.16 ACTV_REC.P$SIG
A_DIO1
  Top 0.61: JP6.13 MXP-A.13
  Bottom 0.406: JP6.13 13.97,46.35 10.16,42.55 10.16,13.97 11.43,12.7 35.56,12.7 36.83,11.43 CAMERA.P$SIG0
A_DIO2  (via drill 0.6)
  Top 0.406: v68.58,57.15 68.58,59.69 76.2,67.31 JP7.2
  Top 0.61: JP6.15 MXP-A.15
  Bottom 0.406: JP6.15 16.51,42.55 20.32,42.55 21.59,41.27 21.59,35.56 23.5,33.66 63.5,33.66 | 63.5,33.66 106.05,33.66 123.19,16.51 LICK.P$SIG1 | 63.5,33.66 63.5,40.64 68.58,45.72 v68.58,57.15
A_DIO3
  Top 0.406: SLN.P$SIG0 144.78,11.43 152.4,19.05 152.4,20.19 R4.1
  Top 0.61: JP6.17 MXP-A.17
  Bottom 0.406: JP6.17 13.97,41.27 13.34,40.64 13.34,19.68 15.24,17.78 69.85,17.78 78.74,8.89 139.7,8.89 SLN.P$SIG0
A_DIO4  (via drill 0.6)
  Top 0.406: JP6.19 16.51,40.01 20.95,40.01 v25.4,35.56 34.29,26.67 v110.49,26.67 | v70.1,72.14 70.1,63.75 v69.85,63.5
  Top 0.61: JP6.19 MXP-A.19
  Bottom 0.406: v25.4,35.56 25.4,57.15 31.75,63.5 v69.85,63.5 | LICK.P$SIG0 120.65,11.43 110.49,21.59 v110.49,26.67 | JP8.2 76.2,78.23 v70.1,72.14
A_DIO5
  Top 0.406: 142.24,25.4 31.75,25.4 19.68,37.47 16.51,37.47 JP6.21 | 142.24,25.4 SLN.P$SIG1 | 142.24,25.4 145.92,25.4 R2.1
  Top 0.61: JP6.21 MXP-A.21
A_DIO6
  Top 0.406: JP6.23 16.51,32.38 19.68,32.38 27.94,24.13 88.9,24.13 101.6,11.43 SHUTTER.P$SIG0
  Top 0.61: JP6.23 MXP-A.23
A_DIO7
  Top 0.61: JP6.25 MXP-A.25
  Bottom 0.406: JP6.25 16.51,32.38 91.44,32.38 104.14,19.68 SHUTTER.P$SIG1
A_DIO8
  Top 0.406: JP6.27 16.51,27.3 22.23,27.3 27.94,21.59 39.37,21.59 CAMERA.P$SIG1
  Top 0.61: JP6.27 MXP-A.27
A_DIO9
  Top 0.61: JP6.29 MXP-A.29
A_DIO10
  Top 0.61: JP6.31 MXP-A.31
  Bottom 0.406: MXP-A.31 5.08,22.23 5.08,13.97 10.79,8.26 62.87,8.26 D_FREE1_2.P$SIG0
A_DIO11  (via drill 0.6)
  Top 0.406: MXP-A.18 5.08,42.55 16.51,42.55 JP6.18 22.23,41.27 35.56,27.94 65.66,27.94 v66.04,28.32 | v66.04,22.23 D_FREE1_2.P$SIG1
  Bottom 0.406: v66.04,28.32 v66.04,22.23
A_DIO12
  Top 0.406: MXP-A.22 5.08,34.92 16.51,34.92 JP6.22
A_DIO13  (via drill 0.6)
  Top 0.406: MXP-A.26 5.08,29.84 16.51,29.84 JP6.26 | v76.2,22.23 v76.2,16.51
  Bottom 0.406: v76.2,16.51 76.2,13.97 78.74,11.43 D_FREE3_4.P$SIG0 | v76.2,22.23 67.31,31.11 JP6.26
A_DIO14
  Top 0.406: MXP-A.32 5.08,22.23 16.51,22.23 JP6.32
A_DIO15
  Top 0.406: MXP-A.34 5.71,19.05 16.51,19.05 17.78,20.32 JP6.34
  Bottom 0.406: JP6.34 19.68,19.05 80.01,19.05 D_FREE3_4.P$SIG1
A_UART.RX
  Top 0.406: JP6.10 16.51,52.7 5.08,52.7 MXP-A.10
A_UART.TX
  Top 0.406: JP6.14 16.51,47.62 5.08,47.62 MXP-A.14
AGND  (via drill 0.6)
  Top 0.406: MXP-B.6 5.08,114.94 16.51,114.94 JP5.6
  Top 0.61: v153.67,63.5 153.67,60.96 v156.21,58.42 | v130.81,86.36 v130.81,111.76
  Bottom 0.406: MXP-B.6 5.08,114.94 16.51,114.94 JP5.6
  Bottom 0.61: v156.21,58.42 156.21,53.34 160.15,49.4 169.29,49.4 S3.4 | v153.67,63.5 v130.81,86.36 | v130.81,111.76 130.81,120.65
  pour Top (isolate 0.61, rank 3, no thermals): 116.84,141.24 -2.54,142.24 -2.54,66.04 30.48,66.04 30.48,110.49 36.83,116.84 116.84,116.84
  pour Bottom (isolate 0.406, no thermals): -1.27,67.31 19.68,67.31 19.68,112.39 26.89,119.6 137.16,119.38 137.16,143.51 -1.27,143.51
B_+3.3V
  Top 0.406: JP5.33 MXP-B.33
B_+5V
  Top 0.406: JP5.1 MXP-B.1
B_AI0
  Top 0.61: JP5.3 MXP-B.3
  Bottom 0.406: JP5.3 16.51,117.47 16.51,121.28 25.4,130.18 64.14,130.18 BAI_0,1.P$SIG0
B_AI1
  Top 0.61: JP5.5 MXP-B.5
  Bottom 0.406: JP5.5 16.51,112.39 20.32,112.39 26.67,118.75 59.05,118.75 BAI_0,1.P$SIG1
B_AI2
  Top 0.61: JP5.7 MXP-B.7
  Bottom 0.406: JP5.7 16.51,109.86 19.68,109.86 27.3,117.47 70.48,117.47 81.28,128.27 BAI_2,3.P$SIG0
B_AI3  (via drill 0.6)
  Top 0.406: BAI_2,3.P$SIG1 v81.28,121.92
  Top 0.61: JP5.9 MXP-B.9
  Bottom 0.406: JP5.9 16.51,107.31 19.05,107.31 27.94,116.2 75.56,116.2 v81.28,121.92
B_AO0
  Top 0.61: MXP-B.2 3.81,120.65 5.08,121.92 16.51,121.92 17.78,120.65 JP5.2
  Bottom 0.406: JP5.2 17.78,120.65 25.4,128.27 BAO_0,1.P$SIG0
B_AO1  (via drill 0.6)
  Top 0.406: MXP-B.4 5.08,117.47 16.51,117.47 JP5.4
  Top 0.61: v24.13,121.92 18.41,116.2 JP5.4
  Bottom 0.406: BAO_0,1.P$SIG1 v24.13,121.92
B_DIO0
  Top 0.61: JP5.11 MXP-B.11
B_DIO1
  Top 0.61: JP5.13 MXP-B.13
B_DIO2
  Top 0.61: JP5.15 MXP-B.15
B_DIO3
  Top 0.61: JP5.17 MXP-B.17
B_DIO4
  Top 0.61: JP5.19 MXP-B.19
B_DIO5
  Top 0.61: JP5.21 MXP-B.21
B_DIO6
  Top 0.61: JP5.23 MXP-B.23
B_DIO7
  Top 0.61: JP5.25 MXP-B.25
B_DIO8
  Top 0.61: JP5.27 MXP-B.27
B_DIO9  (via drill 0.6)
  Top 0.406: v114.3,58.42 v121.92,66.04 v142.24,86.36 | LED_MASK.P$SIG0 177.8,87.63 v171.45,87.63
  Top 0.61: JP5.29 MXP-B.29 | v114.3,45.09 R27.2
  Bottom 0.406: v114.3,58.42 v114.3,45.09 | v121.92,66.04 37.47,66.04 21.59,81.92 16.51,81.92 JP5.29 | v171.45,87.63 170.18,86.36 v142.24,86.36
B_DIO10
  Top 0.61: JP5.31 MXP-B.31
B_DIO11
  Top 0.406: JP5.18 16.51,99.69 5.08,99.69 MXP-B.18
B_DIO12  (via drill 0.6)
  Top 0.406: MXP-B.22 5.08,92.08 16.51,92.08 JP5.22
  Top 0.61: v21.59,45.72 31.75,35.56 140.34,35.56 | v21.59,66.42 21.59,89.53 JP5.22 | 140.34,35.56 147.32,35.56 v152.4,40.64 | R24.2 140.34,35.56
  Bottom 0.406: v21.59,66.42 v21.59,45.72 | LED_CUE.P$SIG 180.34,43.18 175.26,38.1 154.94,38.1 v152.4,40.64
B_DIO13
  Top 0.406: JP5.26 16.51,87 5.08,87 MXP-B.26
B_DIO14  (via drill 0.6)
  Top 0.406: MXP-B.32 5.08,79.38 16.51,79.38 JP5.32 | v147.32,88.9 v123.19,64.77 | v71.12,57.15 71.12,59.69 v73.66,62.23
  Top 0.61: v69.85,45.72 R29.2
  Bottom 0.406: JP5.32 20.95,80.64 36.83,64.77 73.66,64.77 | v123.19,64.77 73.66,64.77 | LED_MASK.P$SIG1 v147.32,88.9 | v69.85,45.72 69.85,55.88 v71.12,57.15 | 73.66,64.77 v73.66,62.23
B_DIO15
  Top 0.406: MXP-B.34 5.71,76.2 15.88,76.2 JP5.34
B_UART.RX
  Top 0.406: JP5.10 16.51,107.31 5.08,107.31 MXP-B.10
B_UART.TX
  Top 0.406: MXP-B.14 5.08,102.23 16.51,102.23 JP5.14
BCKPCK_CTRL2
  Top 0.61: R12.2 107.23,41.02 Q8.C
BCKPCK_CTRL3
  Top 0.61: Q10.C 146.22,41.91 R10.2
CTRL1
  Top 0.61: Q5.C BUCKPUCK1.CTRL
CTRL2
  Top 0.61: Q7.C BUCKPUCK2.CTRL
CTRL3
  Top 0.61: Q9.C BUCKPUCK3.CTRL
DGND  (via drill 0.6)  (8 unrouted)
  Top 0.254: 86.39,106.5 C5.2
  Top 0.406: MXP-A.30 5.08,24.77 16.51,24.77 | MXP-B.8 5.08,112.39 16.51,112.39 JP5.8 | R25.1 C5.2 | MXP-A.8 5.08,55.24 16.51,55.24 JP6.8 | MXP-A.12 5.08,50.16 16.51,50.16 JP6.12 | JP5.30 16.51,84.45 | 16.51,84.45 5.08,84.45 | 5.08,84.45 MXP-B.30 | 16.51,84.45 JP5.28 19.68,87.63 19.68,88.9 JP5.24 | 5.08,84.45 MXP-B.28 | JP5.12 16.51,104.78 5.08,104.78 MXP-B.12 | JP5.20 16.51,94.61 5.08,94.61 MXP-B.20
  Top 0.61: v86.36,70.48 86.36,63.5 | v81.92,97.16 85.72,93.34 C4.2 | C1.- 57.15,62.23 v57.15,70.48
  Bottom 0.61: R34.1 87.63,85.09 | 87.63,85.09 C4.2 | 87.63,85.09 87.63,71.75 v86.36,70.48 | v81.92,97.16 81.92,102.87 85.72,106.68 C5.2 | 57.15,78.74 v57.15,70.48 | R22.1 C8.2 57.15,78.74 | 57.15,78.74 R28.1 C9.2
  other vias: 164.47,23.5 166.37,23.5 168.28,23.5
  pour Bottom (isolate 0.406, rank 2): -1.27,-1.27 191.77,-1.27 191.77,143.51 138.43,143.51 138.43,116.84 118.11,116.84 118.11,66.04 -1.27,66.04
  pour Top (isolate 0.61, rank 2, no thermals): -2.54,-3.81 -2.54,64.77 118.11,64.77 118.11,140.97 191.77,140.97 191.77,-3.81
GND-ISO  (via drill 0.6)
  Top 0.305: OK3.2 100.33,97.79 v102.23,99.69 | OK4.2 100.33,76.2 v102.23,78.11
  Top 0.406: v58.42,107.95 U2.12 | R36.1 v46.99,95.25 | R40.1 v59.05,95.25 | C10.2 v43.81,102.23 | U1.P1 109.39,112.56 v109.22,112.39 | U2.6 U2.7 50.74,102.17 v50.16,101.6 | U2.9 U2.8 55.94,102.17 v56.52,101.6
  Bottom 0.254: R21.E 107.82,100.33
  Bottom 0.406: v59.05,95.25 54.61,95.25 | v50.16,101.6 49.53,101.6 | v56.52,101.6 55.88,101.6
  Bottom 0.61: JP4.3 112.39,116.2 | BAT1.- 114.3,116.84 | JP3.3 101.6,115.57 | 115.57,73.66 127,73.66 156.08,44.58 164.59,44.58 S3.5
  pour Bottom (isolate 0.406): 116.84,66.04 20.95,66.04 20.95,107.95 31.11,118.11 116.84,118.11
LED1+  (via drill 0.6)
  Top 0.61: BUCKPUCK1.LED+ 53.34,41.91 57.15,38.1 v66.04,38.1
  Bottom 0.61: v66.04,38.1 67.31,36.83 135.89,36.83 158.75,13.97 CH1.P1
LED2+
  Bottom 0.61: BUCKPUCK2.LED+ 95.25,38.1 137.16,38.1 167.64,7.62 CH2.P1
LED3+
  Bottom 0.61: CH3.P1 176.53,7.62 142.24,41.91 BUCKPUCK3.LED+
LICK_A0_IN  (via drill 0.6)
  Top 0.406: U1.P2 107.58,110.76 v107.31,110.49 106.36,109.54 101.6,109.54 | 101.6,109.54 Q1.1 | R3.1 101.6,109.54
  Bottom 0.406: JP4.1 v107.31,110.49
LICK_A0_OUT  (via drill 0.36, 0.45, 0.6)
  Top 0.406: R25.2 89.53,104.14 | 89.53,104.14 C5.1 | 89.53,104.14 89.33,103.94 OK3.4 v92.08,100.33 | v81.28,80.26 81.28,87 v81.92,87.63
  Bottom 0.406: v92.08,100.33 92.08,97.79 v81.92,87.63 | JP7.3 80.01,72.39 81.28,73.66 v81.28,80.26
LICK_A1_IN  (via drill 0.6)
  Top 0.406: v105.41,88.9 103.83,87.31 101.6,87.31 | JP4.2 v109.86,115.57 | v114.94,110.49 114.67,110.76 U1.P3 | 101.6,87.31 Q3.1 | R1.1 101.6,87.31
  Bottom 0.406: v105.41,88.9 106.68,88.9 114.94,97.16 v114.94,110.49 v109.86,115.57
LICK_A1_OUT
  Top 0.406: R34.2 89.53,82.55 | 89.53,82.55 C4.1 85.72,81.92 82.55,78.74 JP8.3 | OK4.4 89.33,82.35 89.53,82.55
LICK_B0_IN  (via drill 0.6)
  Top 0.305: v52.7,113.03 52.7,107.31 52.07,106.68 50.8,106.68 U2.4
  Top 0.406: R38.1 48.58,106.68 50.8,106.68
  Bottom 0.406: JP3.1 96.52,123.19 87.63,114.3 53.98,114.3 v52.7,113.03
LICK_B0_OUT  (via drill 0.6)
  Top 0.406: OK1.4 47.83,83.11 45.99,81.28 C8.1 R22.2 | v54.61,81.28 54.61,77.47 56.52,75.56 70.48,75.56 JP7.1
  Bottom 0.406: v54.61,81.28 C8.1
LICK_B1_IN  (via drill 0.6)
  Top 0.406: R42.1 59.88,105.41 | 59.88,105.41 U2.10 | v60.14,106.68 60.14,105.67 59.88,105.41
  Bottom 0.406: JP3.2 99.06,123.19 88.9,113.03 62.23,113.03 60.14,110.94 v60.14,106.68
LICK_B1_OUT
  Top 0.406: OK2.4 66.88,83.11 | 66.88,83.11 71.25,78.74 JP8.1 | R28.2 C9.1 65.04,81.28 66.88,83.11
LICK_DETECT_A0
  Top 0.406: U2.2 43.81,109.22 | 43.81,109.22 40.64,109.22 | 40.64,109.22 R23.A | R35.1 43.81,109.22 | 40.64,109.22 40.64,88.9 39.37,87.63 OK1.2
LICK_DETECT_A1
  Top 0.406: 59.69,109.22 U2.13 | R26.A 63.5,109.22 | 63.5,109.22 59.69,109.22 | 59.69,109.22 59.69,110.43 R39.1 | 63.5,109.22 63.5,90.17 60.96,87.63 OK2.2
N$1
  Top 0.254: R17.1 94.18,106.27 97.74,106.27 R18.2
  Top 0.406: R18.2 97.79,110.32 Q1.3
N$2
  Top 0.61: R30.2 154.94,31.88 155,31.82 | R2.2 155,31.82 | T2.1 160.44,31.82 155,31.82
N$3
  Top 0.61: AUDIO.P$GND0 151.13,125.09 152.4,123.83 154.94,123.83 156.21,125.09 AUDIO.P$GND1
  Bottom 0.61: JP1.SLEEVE 124.46,133.35 135.89,133.35 | 135.89,133.35 143.51,133.35 AUDIO.P$GND0 | JP2.SLEEVE 135.89,133.35
N$4
  Top 0.61: JP1.RING 126.92,129.62 128.27,128.27 140.97,128.27 | AUDIO.P$SIG0 140.97,128.27 | JP2.RING 140.89,128.35 140.97,128.27
N$5
  Top 0.61: JP1.TIP 116.92,132.16 118.11,133.35 129.54,133.35 130.81,132.08 130.81,130.97 JP2.TIP
  Bottom 0.61: JP2.TIP 137.96,123.83 152.4,123.83 153.67,125.09 AUDIO.P$SIG1
N$6
  Top 0.61: T1.1 155.07,20.09 R4.2 154.94,20.32 R31.2
N$7
  Top 0.254: 94.09,84.69 R5.1
  Top 0.305: R6.2 R5.1
  Top 0.406: Q3.3 94.09,88.2 94.09,84.69
N$8  (via drill 0.6)
  Top 0.406: R6.1 97.79,81.28 v95.25,78.74 | v111.12,74.3 110.95,74.12 Q4.B
  Bottom 0.406: v111.12,74.3 99.69,74.3 v95.25,78.74
N$9
  Top 0.305: R8.2 100.15,72.14 OK4.1
N$10
  Top 0.305: R8.1 103.12,73.66 104.78,73.66 106.68,71.75 108.42,71.75 Q4.C
N$11
  Top 0.61: BUCKPUCK3.REF 146.83,49.53 Q9.E 152.34,47.94 R9.1
N$12  (via drill 0.61)
  Top 0.305: v100.13,89.2 100.12,89.22
  Top 0.406: 100.12,89.22 Q3.2
  Bottom 0.406: v100.13,89.2 105.51,83.82 R16.A
N$13
  Top 0.61: POWER_LED.A R7.1
N$14  (via drill 0.6)
  Top 0.406: v95.25,100.33 97.16,102.23 97.16,103.5 97.79,104.14 R18.1 | v111.12,97.16 110.95,96.98 Q2.B
  Bottom 0.406: v111.12,97.16 98.42,97.16 v95.25,100.33
N$15
  Top 0.61: R9.2 152.34,46.04 Q9.B 148.42,41.7 R10.1
N$16
  Top 0.61: C1.+ 58.42,52.07 | C2.+ 101.6,52.07 | VIN.TP 151.13,68.58
  Top 1.016: BUCKPUCK1.VIN+ 58.42,52.07 80.7,52.07 82.35,50.42 87.83,50.42 89.48,52.07 BUCKPUCK2.VIN+ 101.6,52.07 125.15,52.07 126.8,50.42 132.28,50.42 133.93,52.07 BUCKPUCK3.VIN+ 144.78,52.07 C3.+ 151.13,58.42 151.13,68.58 151.13,102.23 153.03,104.14 | U3.1 157.97,104.14 153.03,104.14 | C7.+ 153.03,104.14
  Bottom 1.016: D1.C 163.83,118.11 153.67,107.95 C7.+
N$17
  Top 0.254: R19.2 102.77,95.07 98.75,95.07 OK3.1
N$18
  Top 0.254: 103,96.9 R19.1
  Top 0.305: 103,96.9 104.14,96.9 106.26,94.78 Q2.C
N$19  (via drill 0.61)
  Top 0.406: v102.03,111.43 Q1.2
  Bottom 0.406: v102.03,111.43 102.03,111.33 R21.A
N$20  (via drill 0.6)
  Top 0.61: v154.94,92.71 158.24,89.41 158.24,46.48 160.12,44.6 164.59,44.6 S3.8
  Bottom 0.61: v154.94,92.71 139.7,107.95 BAT1.+
N$21
  Top 0.61: R43.1 183.13,51.05 ISOLATED.A
N$22
  Top 0.61: BUCKPUCK1.REF 56.66,49.53 Q5.E 62.17,47.94 R13.1
N$23
  Top 0.406: OK2.1 57.27,90.49 R20.1
N$24
  Top 0.61: BUCKPUCK2.REF 101.11,49.53 Q7.E 106.62,47.94 R11.1
N$25
  Bottom 0.61: S3.3 168.55,58.04 R43.2
N$27
  Top 0.61: R24.1 140.42,38.27 Q10.B
N$28
  Top 0.61: R27.1 110.38,41.02 Q8.B
N$29
  Top 0.61: R13.2 62.17,46.04 Q5.B 58.25,43.6 R14.1
N$30
  Top 0.61: R29.1 65.3,41.66 Q6.B
N$32  (via drill 1)
  Top 0.61: v184.15,25.4 184.15,22.86
  Top 1.016: R32.1 184.15,22.86 187.32,22.86 J1.1
N$33
  Top 0.61: R11.2 106.62,46.04 Q7.B 102.7,42.97 R12.1
N$34
  Top 0.406: R15.1 35.24,90.17 OK1.1
N$36
  Top 1.016: JP10.PWR 170.18,128.54 170.18,118.11 S1.2
N$37  (via drill 1)
  Top 0.61: v183.51,36.2 183.51,33.66
  Top 1.016: J2.1 183.51,33.66 R33.1
N$42
  Top 0.61: R14.2 62.15,41.66 Q6.C
N$43  (via drill 0.45)
  Top 0.305: U2.5 52.07,105.41 52.7,104.78 v52.7,104.14 52.7,101.28 R37.1
  Top 0.406: R37.1 R36.2
  Bottom 0.406: 39.37,104.14 R23.E | v52.7,104.14 39.37,104.14 | R23.S 39.37,104.14
N$45  (via drill 0.45)
  Top 0.305: U2.11 54.61,106.68 53.98,106.05 v53.98,105.41 53.98,100.97 55.56,99.38 R41.1
  Top 0.406: R40.2 R41.1
  Bottom 0.406: R26.S 69.85,105.41 68.58,105.41 | 68.58,105.41 v53.98,105.41 | 68.58,105.41 R26.E
VCC  (via drill 1)
  Top 0.61: 163.19,97.79 C6.+ | R7.2 166.37,120.65 166.37,105.41 165.1,104.14 163.19,104.14
  Top 1.016: 176.53,22.52 D2.C | 176.53,22.52 178.6,22.52 R32.2 | 176.53,33.31 D3.C | 176.53,33.31 178.6,33.31 R33.2 | v176.53,25.4 176.53,22.52 | 176.53,33.31 v176.53,36.2 177.8,37.47 177.8,58.42 173.99,62.23 167.64,62.23 VSOLN.TP | v163.19,80.01 163.19,97.79 163.19,104.14 163.19,104.28 U3.3
  Bottom 1.016: v176.53,36.2 v176.53,25.4 | v163.19,80.01 161.29,78.11 VSOLN.TP
VIN
  Top 1.016: S1.1 177.55,115.19 D1.A
VOUT-1
  Top 1.016: J1.2 186.4,18.12 D2.A 167.64,18.12 | 167.64,18.12 166.93,18.12 T1.4 | 167.64,18.12 167.3,17.78 T1.2
VOUT-2
  Top 1.016: J2.2 186.69,31.11 184.47,28.89 184.44,28.91 D3.A 172.43,29.21 T2.4 T2.2

### Text on the board
tPlace: LB0 | LB1 | GND | LA0 | LA1 | GND | 5V | AO0 | AI0 | AO1 | AI1 | AGND | AI2 | AI3 | UART.RX | DIO0 | DIO1 | UART.TX | DIO2 | DIO3 | DIO11 | DIO4 | DIO5 | DIO12 | DIO6 | DIO7 | DIO13 | DIO8 | DIO9 | DIO10 | DIO14 | 3.3V | DIO15 | HMS Inst Core / NI MyRIO Expansion G2a / PVG 10/2018 | 5V | AO0 | AI0 | AO1 | AI1 | AGND | AI2 | AI3 | UART.RX | DIO0 | DIO1 | UART.TX | DIO2 | DIO3 | DIO11 | DIO4 | DIO5 | DIO12 | + | DIO6 | DIO7 | DIO13 | DIO8 | DIO9 | + | DIO10 | DIO14 | 3.3V | DIO15 | A_DIO1 / A_DIO8 | A_DIO10 / A_DIO11 | A_DIO13 / A_DIO15 | A_DIO6 / A_DIO7 | A_DIO4 / A_DIO2 | A_DIO3 / A_DIO5 | A_DIO0 | LED 1 | + | LED 2 | + | LED 3 | +
tNames: Lick circuit B | Lick circuit A | Lick circuit selection | 5V Soln